# Altium project SAMA5D27-SOM1.PrjPcb (part 1 of 2)
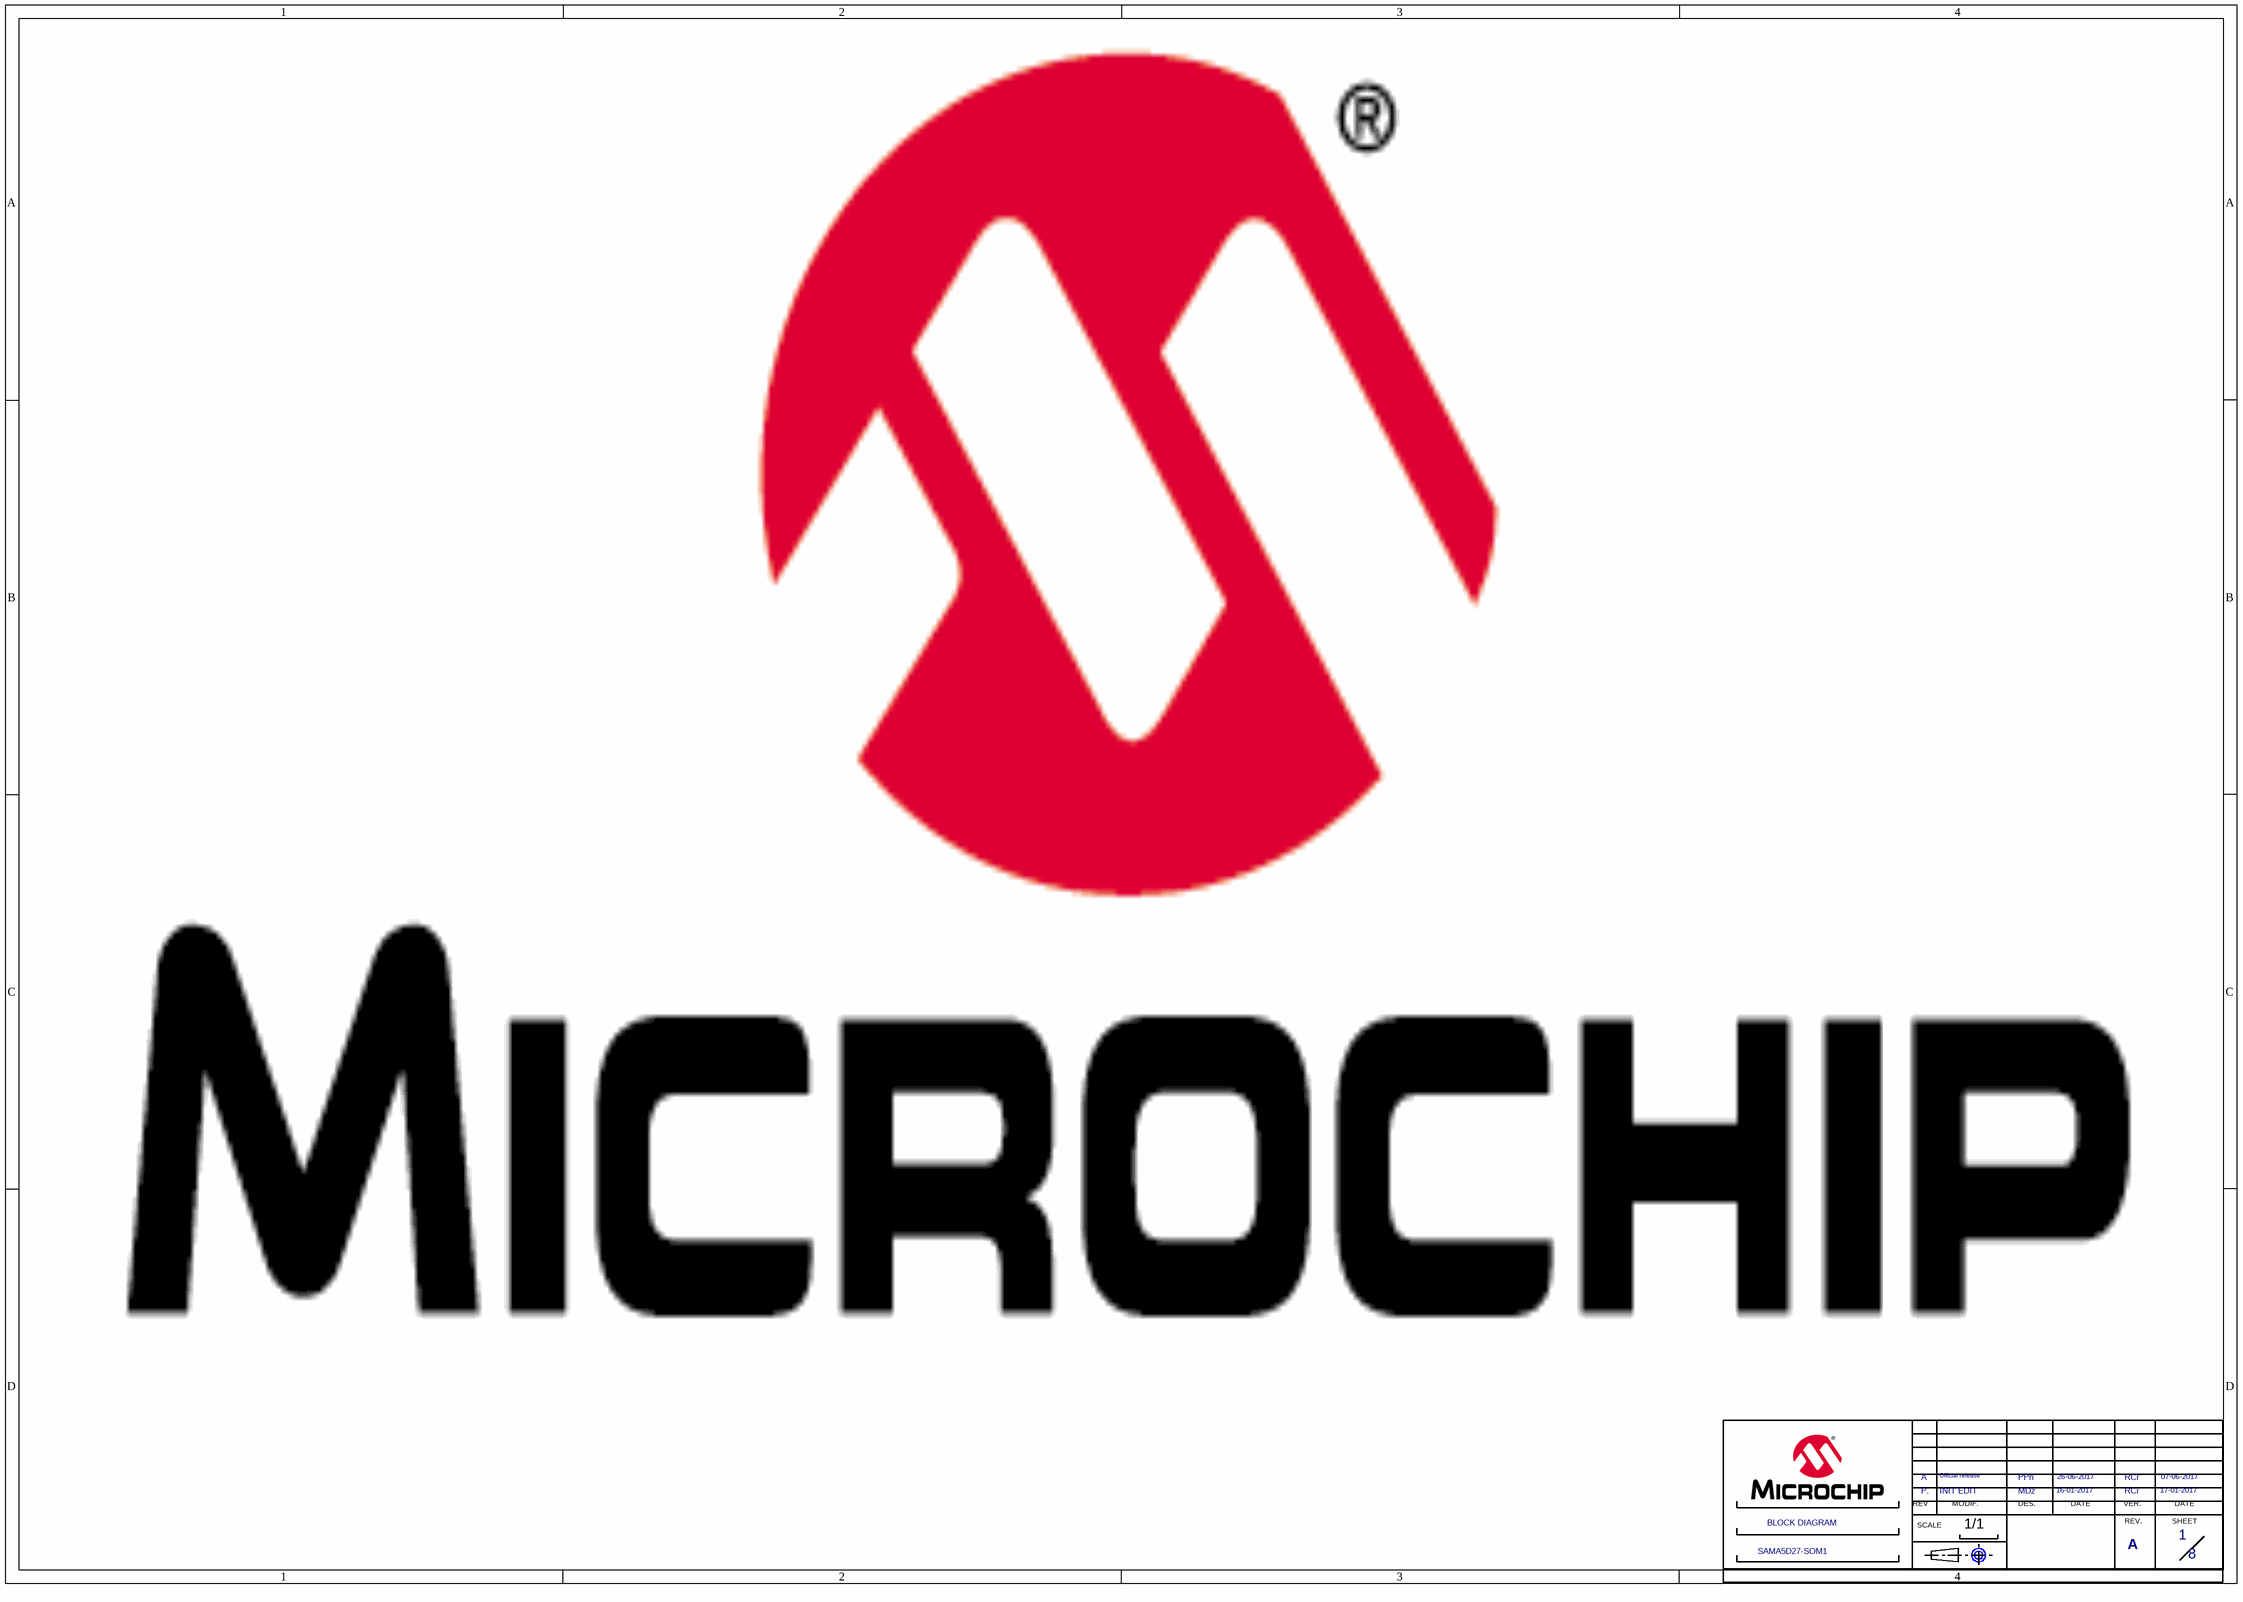
[diagram p0: 1-BLOCK DIAGRAM.SchDoc]
ProjectTitle: Project Title; ProjectRevisionSCH: A; ProjectRevisionFAB: A; ProjectRevisionASSY: A; ProjectRevisionART: A; ProjectPartNumber: MPU32; ProjectEngineer: TBD; ProjectDrawnBy: TBD; ProjectBoardNumber: TBD
8 sheets, 204 parts. Net scope: global (net labels, ports and power ports of the same name join across sheets).
Board file: SAMA5D27-SOM1-MFG-03.PcbDoc
Sheets:
  1-BLOCK DIAGRAM.SchDoc
  2-Supplies.SchDoc
  3-Microcontroller.SchDoc
  4-Microcontroller.SchDoc
  5-Memories.SchDoc
  6-Ethernet.SchDoc
  7-SOM PIO.SchDoc
  8-Mechanical.SchDoc

## Sheet 1-BLOCK DIAGRAM.SchDoc
size 420 x 297 mm; CompanyName: Microchip Technology Inc.; Organization: Microchip Technology; Address1: 2355 West Chandler Blvd.; Address2: Chandler, AZ  85224; Address4: USA; SheetTitle: **; Time: Time

### Parts
(Parts that share a designator on the sheet are numbered #1, #2 ... from top to bottom, then left to right.)
*#1  MODIF.A: INIT EDIT  SHEET NAME 2: BLOCK DIAGRAM  SHEET NAME 1: SAMA5D27-SOM1  REV B: A  VERIF B: RCr  VERIF DATE A: 17-01-2017  VERIF DATE B: 07-06-2017  Page Count: 8  Page Number: 1  DATE A: 16-01-2017  DATE B: 26-06-2017  DES A: MDz  DES B: PPn  MODIF.B: Official release  REV A: P.  (hidden comment: CARTOUCHE MICROCHIP)  (graphical)
?#1  (no value)  (graphical)

### Notes on the sheet
- Drawn By:
- Engineer:
- PartNumber:
- Project Title
- Sheet Title
- Size
- B
- Revision:
- Sch #:
- Date:
- Sheet
- Designed with
- Altium.com <http://go.altium.com/MicrochipLandingPage_Evaluation.html>
- File:
- (in symbol CARTOUCHE MICROCHIP) REV; MODIF.; DES.; DATE; VER.; SCALE; REV.; SHEET; 1/1

### Library data of the parts
*#1 = CARTOUCHE MICROCHIP: REV D: D; REV C: C; REV F: F; REV E: E; VERIF F: XXX; VERIF DATE F: XX-XXX-XX; MODIF.C: RevC; MODIF.D: RevD; MODIF.E: RevE; MODIF.F: RevF; VERIF E: XXX; VERIF D: XXX; VERIF C: RCr; VERIF A: RCr; VERIF DATE E: XX-XXX-XX; VERIF DATE D: XX-XXX-XX; VERIF DATE C: 07-06-2017; REV: A; FT: ?; Page Size: A; Page Create Date: june 19, 2004; DATE C: 07-06-2017; DATE D: XX-XXX-XX; DATE E: XX-XXX-XX; DATE F: XX-XXX-XX; DES E: XXX; DES F: XXX; DES C: XXX; DES D: XXX
?#1 = Title Block B

## Sheet 2-Supplies.SchDoc
size 420 x 297 mm; CompanyName: Microchip Technology Inc.; Organization: Microchip Technology; Address1: 2355 West Chandler Blvd.; Address2: Chandler, AZ  85224; Address4: USA; SheetTitle: **; Time: Time
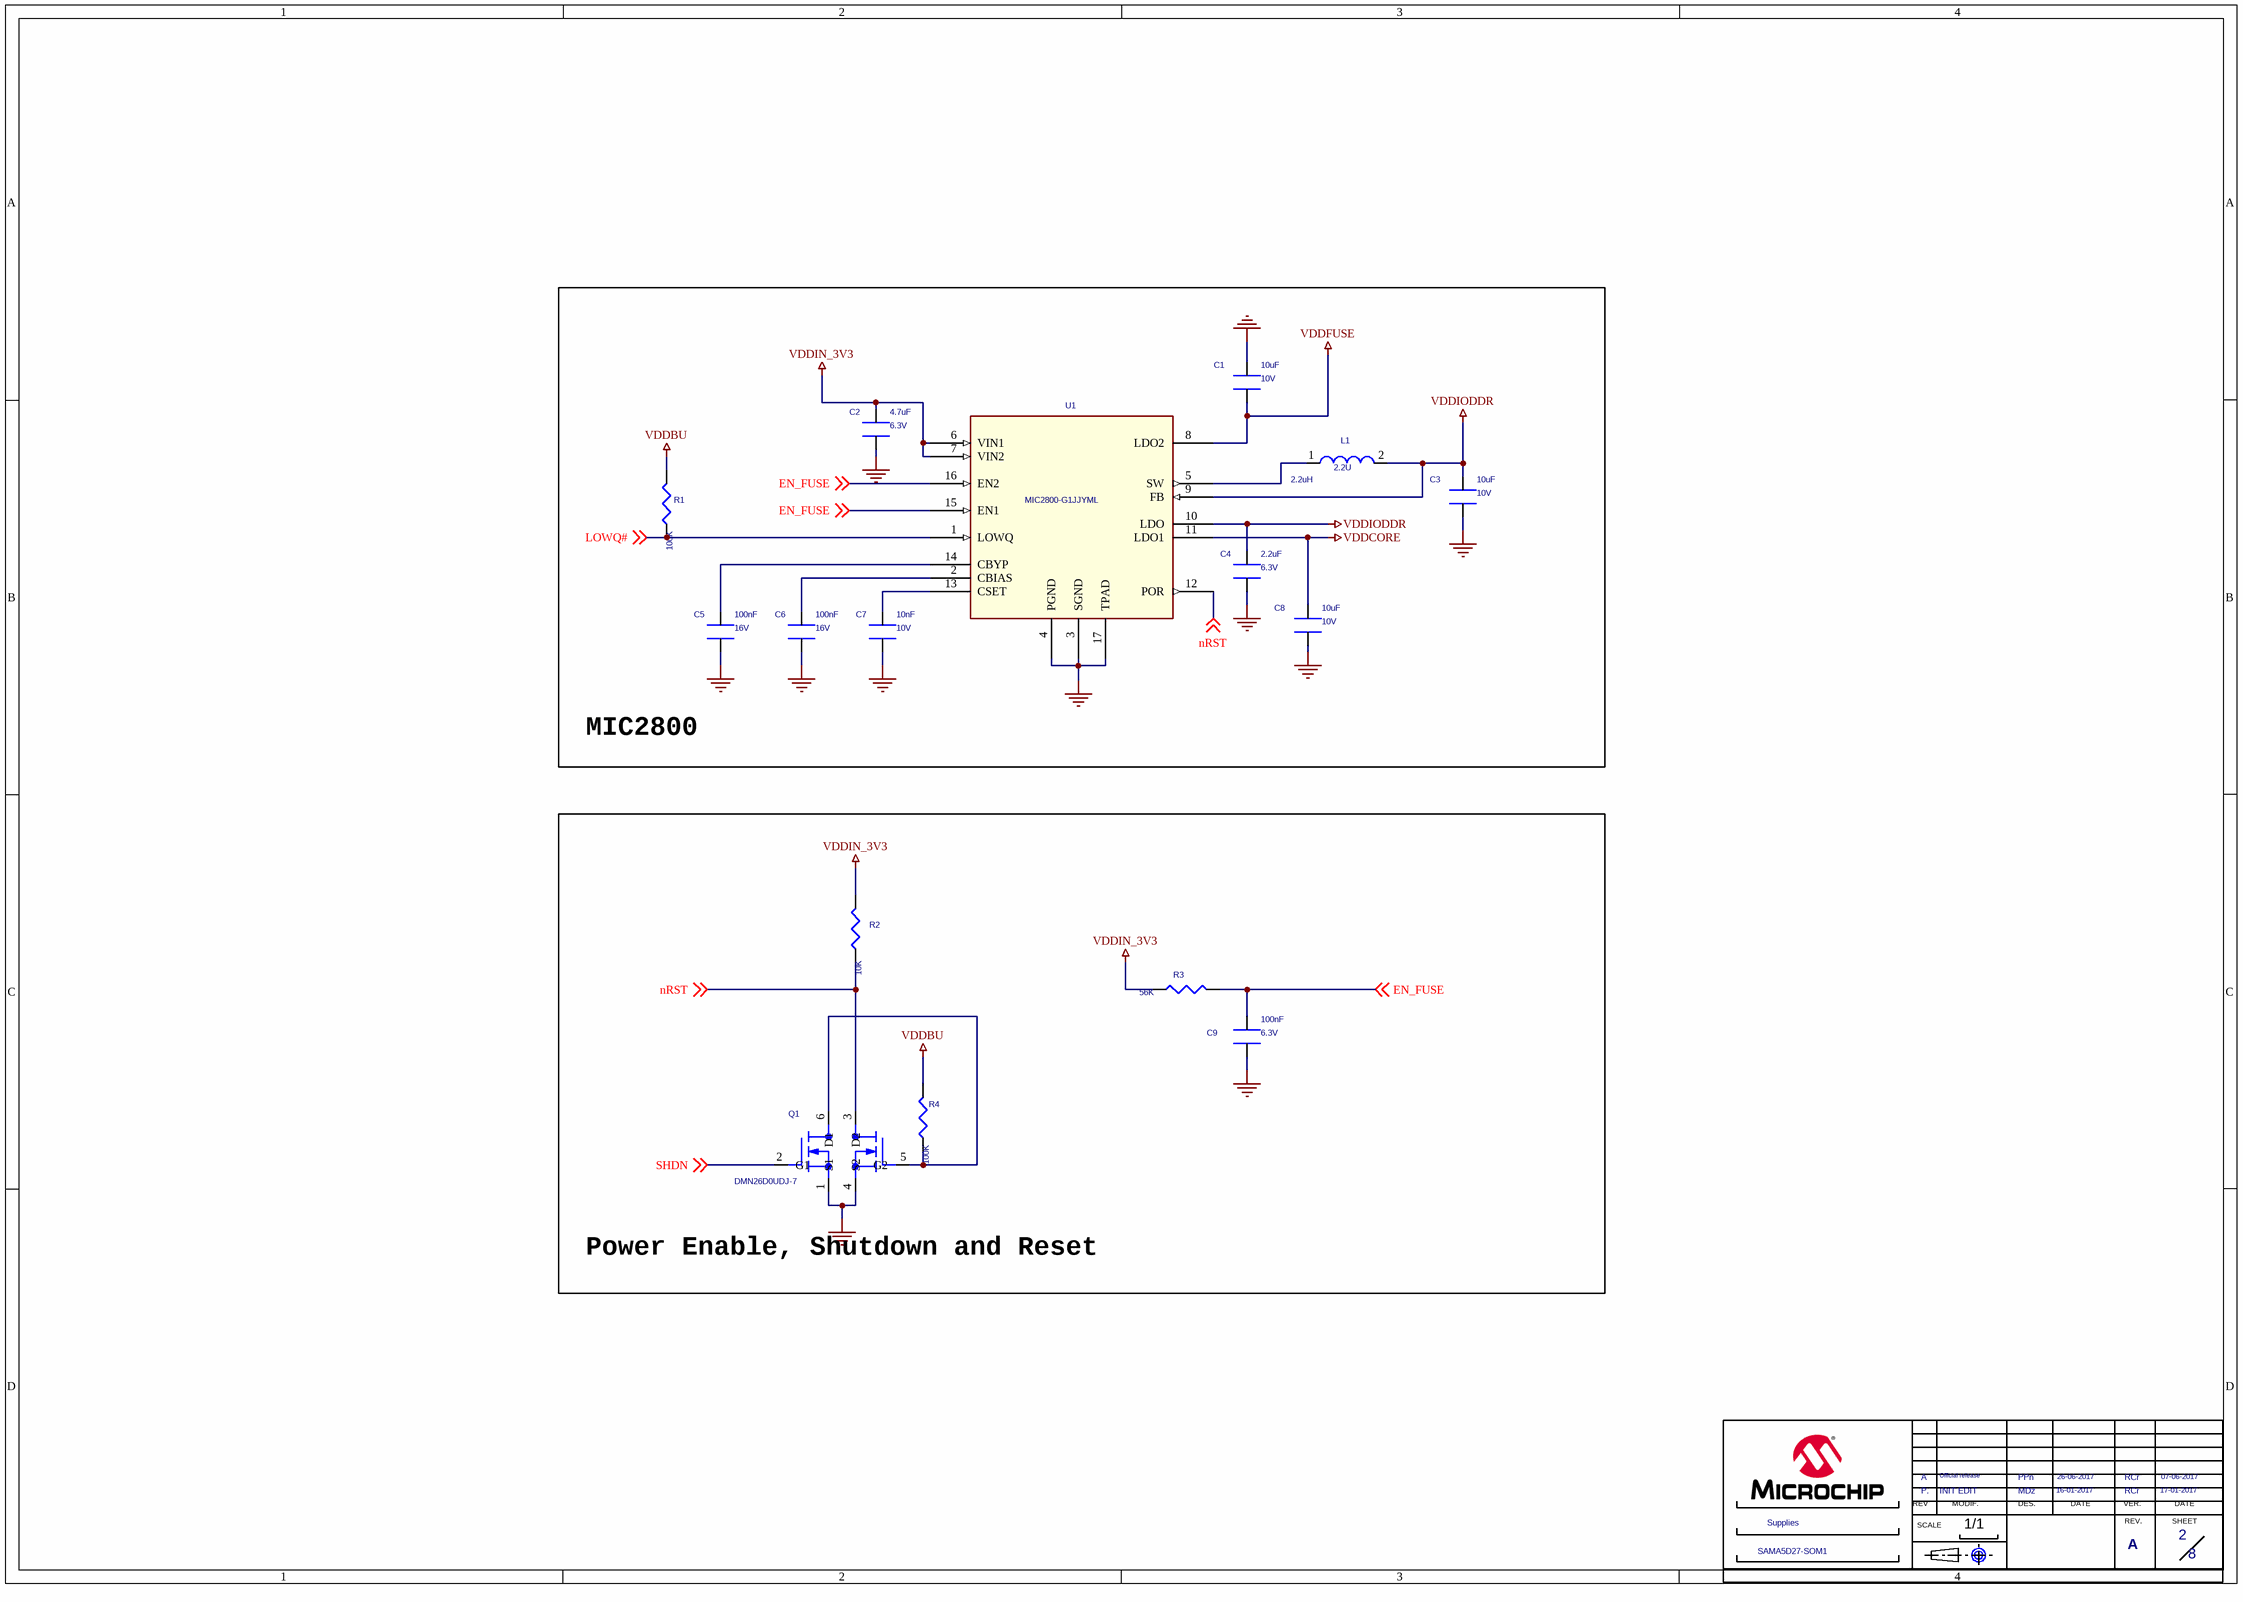
[diagram p1: 2-Supplies.SchDoc]

### Parts
(Parts that share a designator on the sheet are numbered #1, #2 ... from top to bottom, then left to right.)
*#2  MODIF.A: INIT EDIT  SHEET NAME 2: Supplies  SHEET NAME 1: SAMA5D27-SOM1  REV B: A  VERIF B: RCr  VERIF DATE A: 17-01-2017  VERIF DATE B: 07-06-2017  Page Count: 8  Page Number: 2  DATE A: 16-01-2017  DATE B: 26-06-2017  DES A: MDz  DES B: PPn  MODIF.B: Official release  REV A: P.  (hidden comment: CARTOUCHE MICROCHIP)  (graphical)
?#2  (no value)  (graphical)
C1  TENSION: 10V  VALEUR: 10uF  [C0603]  (hidden comment: xpF x% xV)
C2  TENSION: 6.3V  VALEUR: 4.7uF  [C0402]  (hidden comment: xpF x% xV)
C3  TENSION: 10V  VALEUR: 10uF  [C0603]  (hidden comment: xpF x% xV)
C4  TENSION: 6.3V  VALEUR: 2.2uF  [C0603]  (hidden comment: xpF x% xV)
C5  TENSION: 16V  VALEUR: 100nF  [C0402]  (hidden comment: xpF x% xV)
C6  TENSION: 16V  VALEUR: 100nF  [C0402]  (hidden comment: xpF x% xV)
C7  TENSION: 10V  VALEUR: 10nF  [C0201]  (hidden comment: xpF x% xV)
C8  TENSION: 10V  VALEUR: 10uF  [C0603]  (hidden comment: xpF x% xV)
C9  VALEUR: 100nF  TENSION: 6.3V  [C0201]  (hidden comment: xpF x% xV)
L1  2.2U  Valeur: 2.2uH  [L2520]
Q1  DMN26D0UDJ-7  [SOT963_01]
R1  VALEUR: 100K  [R0201]  (hidden comment: xR x% xW)
R2  VALEUR: 10K  [R0201]  (hidden comment: xR x% xW)
R3  VALEUR: 56K  [R0201]  (hidden comment: xR x% xW)
R4  VALEUR: 100K  [R0201]  (hidden comment: xR x% xW)
U1  MIC2800-G1JJYML  [QFN16_02]

### Blocks framed on the sheet
MIC2800: C1-C8 L1 R1 U1
Power Enable, Shutdown and Reset: C9 Q1 R2-R4

### Nets
GND: C1.2 C2.1 C3.1 C4.1 C5.1 C6.1 C7.1 C8.1 C9.1 Q1.1(S1) Q1.4(S2) U1.3(SGND) U1.4(PGND) U1.17(TPAD)
VDDBU: R1.2 R4.2
VDDCORE: C8.2 U1.11(LDO1)
VDDFUSE: C1.1 U1.8(LDO2)
VDDIN_3V3: C2.2 R2.2 R3.1 U1.6(VIN1) U1.7(VIN2)
VDDIODDR: C3.2 C4.2 L1.2 U1.9(FB) U1.10(LDO)
EN_FUSE: C9.2 R3.2 U1.15(EN1) U1.16(EN2) ; off-sheet EN_FUSE
LOWQ#: R1.1 U1.1(LOWQ) ; off-sheet LOWQ#
nRST: Q1.3(D2) R2.1 U1.12(POR) ; off-sheet nRST
SHDN: Q1.2(G1) ; off-sheet SHDN
NetC5_2: C5.2 U1.14(CBYP)
NetC6_2: C6.2 U1.2(CBIAS)
NetC7_2: C7.2 U1.13(CSET)
NetL1_1: L1.1 U1.5(SW)
NetQ1_5: Q1.5(G2) Q1.6(D1) R4.1

### Notes on the sheet
- Drawn By:
- Engineer:
- PartNumber:
- Project Title
- Sheet Title
- Size
- B
- Revision:
- Sch #:
- Date:
- Sheet
- Designed with
- Altium.com <http://go.altium.com/MicrochipLandingPage_Evaluation.html>
- File:
- (in symbol CARTOUCHE MICROCHIP) REV; MODIF.; DES.; DATE; VER.; SCALE; REV.; SHEET; 1/1

### Library data of the parts
*#2 = CARTOUCHE MICROCHIP: as *#1 on sheet 1-BLOCK DIAGRAM; VERIF E: XXX; VERIF D: XXX; VERIF C: RCr; VERIF A: RCr; VERIF DATE E: XX-XXX-XX; VERIF DATE D: XX-XXX-XX; VERIF DATE C: 07-06-2017; REV: A; FT: ?; Page Size: A; Page Create Date: june 19, 2004; DATE C: 07-06-2017; DATE D: XX-XXX-XX; DATE E: XX-XXX-XX; DATE F: XX-XXX-XX; DES E: XXX; DES F: XXX; DES C: XXX; DES D: XXX
?#2 = Title Block B
C1 C3 C8 = C0603-10uF-X5R-10V-10%: COURANT: xA; HAUTEUR: xmm; TOLERENCE: 10%; DESIGNATION: Condensateur CMS céramique; BOITIER: 0603; DIELECTRIQUE: X5R; TEMPERATURE: 40°C/+85°C
C2 = C0402-4.7uF-X5R-6.3V-10%: COURANT: xA; HAUTEUR: xmm; TOLERENCE: 10%; DESIGNATION: Condensateur CMS céramique; BOITIER: 0402; DIELECTRIQUE: X5R; TEMPERATURE: 40°C/+85°C
C4 = C0603-2.2uF-X7R-6.3V-10%: COURANT: xA; HAUTEUR: xmm; TOLERENCE: 10%; DESIGNATION: Condensateur CMS céramique; BOITIER: 0603; DIELECTRIQUE: X7R; TEMPERATURE: 40°C/+85°C
C5 C6 = C0402-100nF-X7R-16V-10%: COURANT: xA; HAUTEUR: xmm; TOLERENCE: 10%; DESIGNATION: Condensateur CMS céramique; BOITIER: 0402; DIELECTRIQUE: X7R; TEMPERATURE: 40°C/+85°C
C7 = C0201-10nF-X7R-10V: COURANT: xA; HAUTEUR: xmm; TOLERENCE: ?%; DESIGNATION: Condensateur CMS céramique; BOITIER: 0201; DIELECTRIQUE: X7R; TEMPERATURE: 40°C/+85°C
C9 = C0201-100nF-X5R-6.3V: DIELECTRIQUE: X5R; BOITIER: 0201; DESIGNATION: Condensateur CMS céramique; TOLERENCE: ?%; HAUTEUR: xmm; COURANT: xA; TEMPERATURE: 40°C/+85°C
L1 = MLP2520H2R2MT0S1: TOLERANCE: 20%; FABRICANT: TDK; type: ???; DESIGNATION: Inductance CMS; TEMPERATURE: -40°C/+125°C; partnumber: MLP2520H2R2MT0S1
Q1 = DMN26D0UDJ-7: FABRICANT: Diodes Incorporated; DESIGNATION: Mosfet dual N-CH 20V 0.23A; TEMPERATURE: -55°C/+150°C
R1 R4 = R0201-100K-5%: TENSION: xV; BOITIER: 0201; COURANT: xA; DESIGNATION: Resistance CMS; TOLERANCE: 5%; PUISSANCE: xW; TEMPERATURE: -40°C/+85°C
R2 = R0201-10K-5%: TENSION: xV; BOITIER: 0201; COURANT: xA; DESIGNATION: Resistance CMS; TOLERANCE: 5%; PUISSANCE: xW; TEMPERATURE: -40°C/+85°C
R3 = R0201-56K-5%: TOLERANCE: 5%; DESIGNATION: Resistance CMS; COURANT: xA; BOITIER: 0201; TENSION: xV; TEMPERATURE: -40°C/+85°C; PUISSANCE: xW
U1 = MIC2800-G1JJYML: FABRICANT: MICROCHIP; DESIGNATION: Linear Voltage Regulators; TEMPERATURE: -40°C/+125°C

## Sheet 3-Microcontroller.SchDoc
size 420 x 297 mm; CompanyName: Microchip Technology Inc.; Organization: Microchip Technology; Address1: 2355 West Chandler Blvd.; Address2: Chandler, AZ  85224; Address4: USA; SheetTitle: **; Time: Time
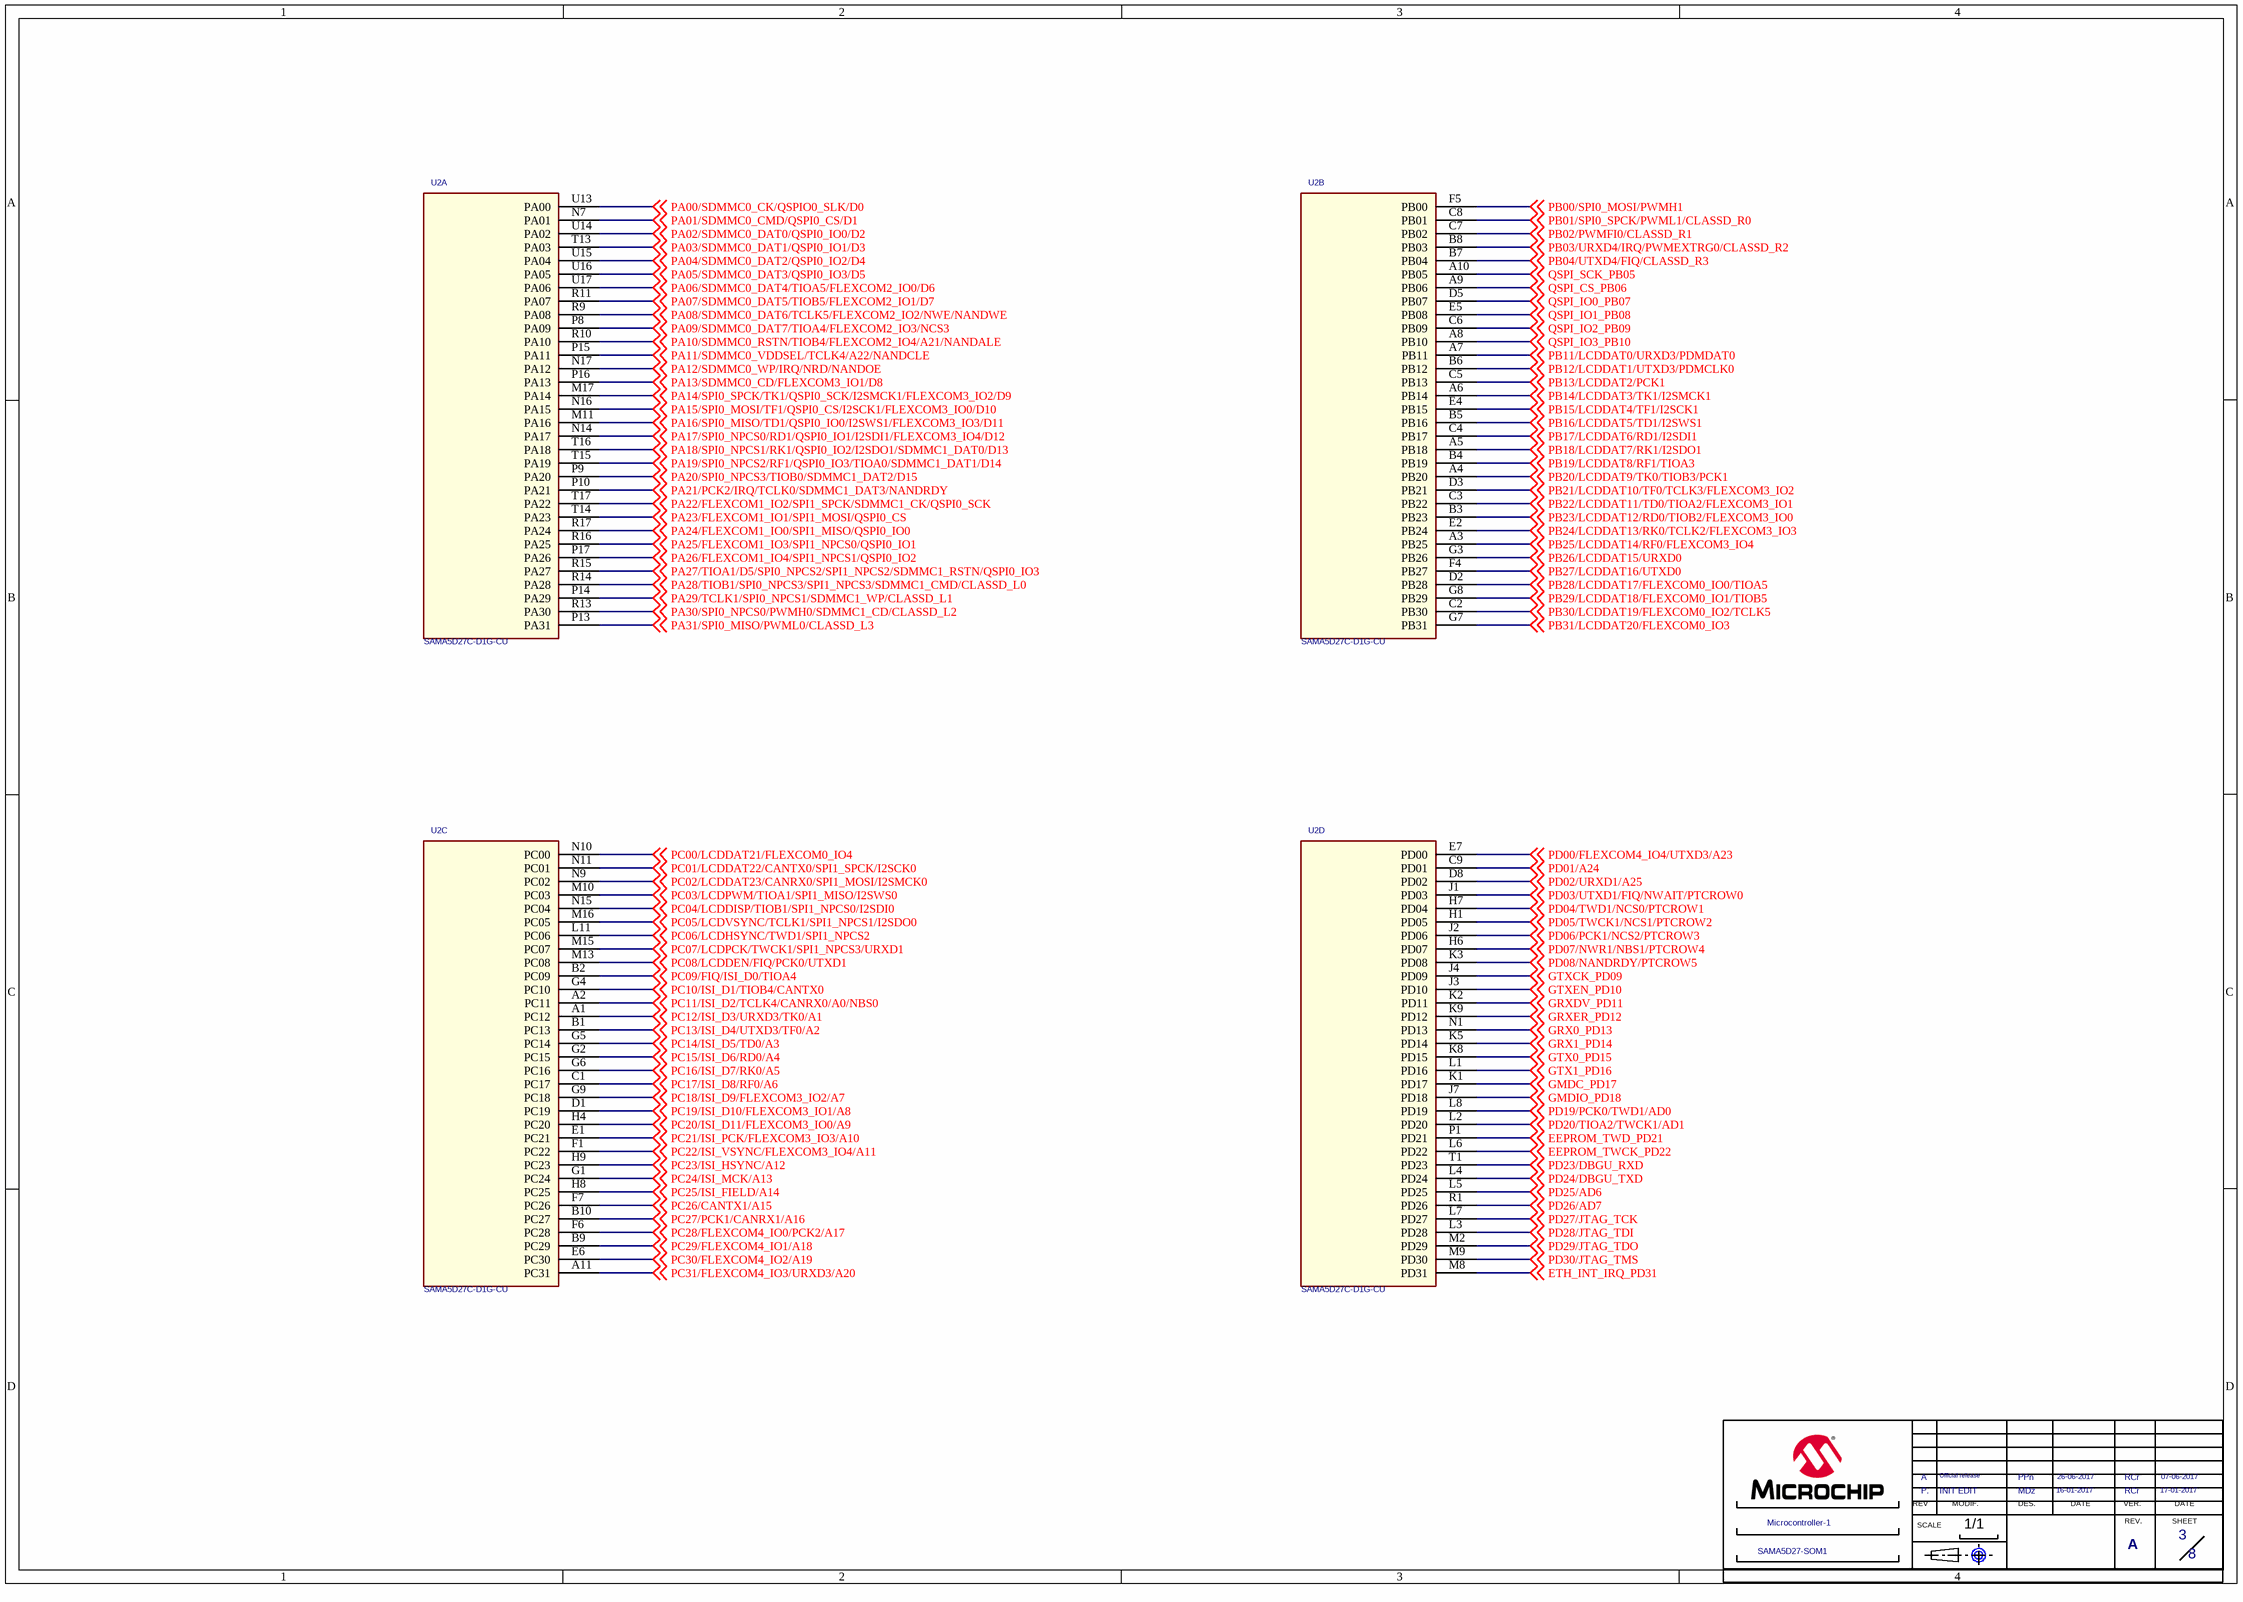
[diagram p2: 3-Microcontroller.SchDoc]

### Parts
(Parts that share a designator on the sheet are numbered #1, #2 ... from top to bottom, then left to right.)
*#3  MODIF.A: INIT EDIT  SHEET NAME 2: Microcontroller-1  SHEET NAME 1: SAMA5D27-SOM1  REV B: A  VERIF B: RCr  VERIF DATE A: 17-01-2017  VERIF DATE B: 07-06-2017  Page Count: 8  Page Number: 3  DATE A: 16-01-2017  DATE B: 26-06-2017  DES A: MDz  DES B: PPn  MODIF.B: Official release  REV A: P.  (hidden comment: CARTOUCHE MICROCHIP)  (graphical)
?#3  (no value)  (graphical)
U2  SAMA5D27C-D1G-CU  [BGA289_02]  (parts A,B,C,D of 7)

### Nets
EEPROM_TWCK_PD22: U2.L6(PD22) ; off-sheet EEPROM_TWCK_PD22
EEPROM_TWD_PD21: U2.P1(PD21) ; off-sheet EEPROM_TWD_PD21
ETH_INT_IRQ_PD31: U2.M8(PD31) ; off-sheet ETH_INT_IRQ_PD31
GMDC_PD17: U2.K1(PD17) ; off-sheet GMDC_PD17
GMDIO_PD18: U2.J7(PD18) ; off-sheet GMDIO_PD18
GRX0_PD13: U2.N1(PD13) ; off-sheet GRX0_PD13
GRX1_PD14: U2.K5(PD14) ; off-sheet GRX1_PD14
GRXDV_PD11: U2.K2(PD11) ; off-sheet GRXDV_PD11
GRXER_PD12: U2.K9(PD12) ; off-sheet GRXER_PD12
GTX0_PD15: U2.K8(PD15) ; off-sheet GTX0_PD15
GTX1_PD16: U2.L1(PD16) ; off-sheet GTX1_PD16
GTXCK_PD09: U2.J4(PD09) ; off-sheet GTXCK_PD09
GTXEN_PD10: U2.J3(PD10) ; off-sheet GTXEN_PD10
PA00/SDMMC0_CK/QSPIO0_SLK/D0: U2.U13(PA00) ; off-sheet PA00/SDMMC0_CK/QSPIO0_SLK/D0
PA01/SDMMC0_CMD/QSPI0_CS/D1: U2.N7(PA01) ; off-sheet PA01/SDMMC0_CMD/QSPI0_CS/D1
PA02/SDMMC0_DAT0/QSPI0_IO0/D2: U2.U14(PA02) ; off-sheet PA02/SDMMC0_DAT0/QSPI0_IO0/D2
PA03/SDMMC0_DAT1/QSPI0_IO1/D3: U2.T13(PA03) ; off-sheet PA03/SDMMC0_DAT1/QSPI0_IO1/D3
PA04/SDMMC0_DAT2/QSPI0_IO2/D4: U2.U15(PA04) ; off-sheet PA04/SDMMC0_DAT2/QSPI0_IO2/D4
PA05/SDMMC0_DAT3/QSPI0_IO3/D5: U2.U16(PA05) ; off-sheet PA05/SDMMC0_DAT3/QSPI0_IO3/D5
PA06/SDMMC0_DAT4/TIOA5/FLEXCOM2_IO0/D6: U2.U17(PA06) ; off-sheet PA06/SDMMC0_DAT4/TIOA5/FLEXCOM2_IO0/D6
PA07/SDMMC0_DAT5/TIOB5/FLEXCOM2_IO1/D7: U2.R11(PA07) ; off-sheet PA07/SDMMC0_DAT5/TIOB5/FLEXCOM2_IO1/D7
PA08/SDMMC0_DAT6/TCLK5/FLEXCOM2_IO2/NWE/NANDWE: U2.R9(PA08) ; off-sheet PA08/SDMMC0_DAT6/TCLK5/FLEXCOM2_IO2/NWE/NANDWE
PA09/SDMMC0_DAT7/TIOA4/FLEXCOM2_IO3/NCS3: U2.P8(PA09) ; off-sheet PA09/SDMMC0_DAT7/TIOA4/FLEXCOM2_IO3/NCS3
PA10/SDMMC0_RSTN/TIOB4/FLEXCOM2_IO4/A21/NANDALE: U2.R10(PA10) ; off-sheet PA10/SDMMC0_RSTN/TIOB4/FLEXCOM2_IO4/A21/NANDALE
PA11/SDMMC0_VDDSEL/TCLK4/A22/NANDCLE: U2.P15(PA11) ; off-sheet PA11/SDMMC0_VDDSEL/TCLK4/A22/NANDCLE
PA12/SDMMC0_WP/IRQ/NRD/NANDOE: U2.N17(PA12) ; off-sheet PA12/SDMMC0_WP/IRQ/NRD/NANDOE
PA13/SDMMC0_CD/FLEXCOM3_IO1/D8: U2.P16(PA13) ; off-sheet PA13/SDMMC0_CD/FLEXCOM3_IO1/D8
PA14/SPI0_SPCK/TK1/QSPI0_SCK/I2SMCK1/FLEXCOM3_IO2/D9: U2.M17(PA14) ; off-sheet PA14/SPI0_SPCK/TK1/QSPI0_SCK/I2SMCK1/FLEXCOM3_IO2/D9
PA15/SPI0_MOSI/TF1/QSPI0_CS/I2SCK1/FLEXCOM3_IO0/D10: U2.N16(PA15) ; off-sheet PA15/SPI0_MOSI/TF1/QSPI0_CS/I2SCK1/FLEXCOM3_IO0/D10
PA16/SPI0_MISO/TD1/QSPI0_IO0/I2SWS1/FLEXCOM3_IO3/D11: U2.M11(PA16) ; off-sheet PA16/SPI0_MISO/TD1/QSPI0_IO0/I2SWS1/FLEXCOM3_IO3/D11
PA17/SPI0_NPCS0/RD1/QSPI0_IO1/I2SDI1/FLEXCOM3_IO4/D12: U2.N14(PA17) ; off-sheet PA17/SPI0_NPCS0/RD1/QSPI0_IO1/I2SDI1/FLEXCOM3_IO4/D12
PA18/SPI0_NPCS1/RK1/QSPI0_IO2/I2SDO1/SDMMC1_DAT0/D13: U2.T16(PA18) ; off-sheet PA18/SPI0_NPCS1/RK1/QSPI0_IO2/I2SDO1/SDMMC1_DAT0/D13
PA19/SPI0_NPCS2/RF1/QSPI0_IO3/TIOA0/SDMMC1_DAT1/D14: U2.T15(PA19) ; off-sheet PA19/SPI0_NPCS2/RF1/QSPI0_IO3/TIOA0/SDMMC1_DAT1/D14
PA20/SPI0_NPCS3/TIOB0/SDMMC1_DAT2/D15: U2.P9(PA20) ; off-sheet PA20/SPI0_NPCS3/TIOB0/SDMMC1_DAT2/D15
PA21/PCK2/IRQ/TCLK0/SDMMC1_DAT3/NANDRDY: U2.P10(PA21) ; off-sheet PA21/PCK2/IRQ/TCLK0/SDMMC1_DAT3/NANDRDY
PA22/FLEXCOM1_IO2/SPI1_SPCK/SDMMC1_CK/QSPI0_SCK: U2.T17(PA22) ; off-sheet PA22/FLEXCOM1_IO2/SPI1_SPCK/SDMMC1_CK/QSPI0_SCK
PA23/FLEXCOM1_IO1/SPI1_MOSI/QSPI0_CS: U2.T14(PA23) ; off-sheet PA23/FLEXCOM1_IO1/SPI1_MOSI/QSPI0_CS
PA24/FLEXCOM1_IO0/SPI1_MISO/QSPI0_IO0: U2.R17(PA24) ; off-sheet PA24/FLEXCOM1_IO0/SPI1_MISO/QSPI0_IO0
PA25/FLEXCOM1_IO3/SPI1_NPCS0/QSPI0_IO1: U2.R16(PA25) ; off-sheet PA25/FLEXCOM1_IO3/SPI1_NPCS0/QSPI0_IO1
PA26/FLEXCOM1_IO4/SPI1_NPCS1/QSPI0_IO2: U2.P17(PA26) ; off-sheet PA26/FLEXCOM1_IO4/SPI1_NPCS1/QSPI0_IO2
PA27/TIOA1/D5/SPI0_NPCS2/SPI1_NPCS2/SDMMC1_RSTN/QSPI0_IO3: U2.R15(PA27) ; off-sheet PA27/TIOA1/D5/SPI0_NPCS2/SPI1_NPCS2/SDMMC1_RSTN/QSPI0_IO3
PA28/TIOB1/SPI0_NPCS3/SPI1_NPCS3/SDMMC1_CMD/CLASSD_L0: U2.R14(PA28) ; off-sheet PA28/TIOB1/SPI0_NPCS3/SPI1_NPCS3/SDMMC1_CMD/CLASSD_L0
PA29/TCLK1/SPI0_NPCS1/SDMMC1_WP/CLASSD_L1: U2.P14(PA29) ; off-sheet PA29/TCLK1/SPI0_NPCS1/SDMMC1_WP/CLASSD_L1
PA30/SPI0_NPCS0/PWMH0/SDMMC1_CD/CLASSD_L2: U2.R13(PA30) ; off-sheet PA30/SPI0_NPCS0/PWMH0/SDMMC1_CD/CLASSD_L2
PA31/SPI0_MISO/PWML0/CLASSD_L3: U2.P13(PA31) ; off-sheet PA31/SPI0_MISO/PWML0/CLASSD_L3
PB00/SPI0_MOSI/PWMH1: U2.F5(PB00) ; off-sheet PB00/SPI0_MOSI/PWMH1
PB01/SPI0_SPCK/PWML1/CLASSD_R0: U2.C8(PB01) ; off-sheet PB01/SPI0_SPCK/PWML1/CLASSD_R0
PB02/PWMFI0/CLASSD_R1: U2.C7(PB02) ; off-sheet PB02/PWMFI0/CLASSD_R1
PB03/URXD4/IRQ/PWMEXTRG0/CLASSD_R2: U2.B8(PB03) ; off-sheet PB03/URXD4/IRQ/PWMEXTRG0/CLASSD_R2
PB04/UTXD4/FIQ/CLASSD_R3: U2.B7(PB04) ; off-sheet PB04/UTXD4/FIQ/CLASSD_R3
PB11/LCDDAT0/URXD3/PDMDAT0: U2.A7(PB11) ; off-sheet PB11/LCDDAT0/URXD3/PDMDAT0
PB12/LCDDAT1/UTXD3/PDMCLK0: U2.B6(PB12) ; off-sheet PB12/LCDDAT1/UTXD3/PDMCLK0
PB13/LCDDAT2/PCK1: U2.C5(PB13) ; off-sheet PB13/LCDDAT2/PCK1
PB14/LCDDAT3/TK1/I2SMCK1: U2.A6(PB14) ; off-sheet PB14/LCDDAT3/TK1/I2SMCK1
PB15/LCDDAT4/TF1/I2SCK1: U2.E4(PB15) ; off-sheet PB15/LCDDAT4/TF1/I2SCK1
PB16/LCDDAT5/TD1/I2SWS1: U2.B5(PB16) ; off-sheet PB16/LCDDAT5/TD1/I2SWS1
PB17/LCDDAT6/RD1/I2SDI1: U2.C4(PB17) ; off-sheet PB17/LCDDAT6/RD1/I2SDI1
PB18/LCDDAT7/RK1/I2SDO1: U2.A5(PB18) ; off-sheet PB18/LCDDAT7/RK1/I2SDO1
PB19/LCDDAT8/RF1/TIOA3: U2.B4(PB19) ; off-sheet PB19/LCDDAT8/RF1/TIOA3
PB20/LCDDAT9/TK0/TIOB3/PCK1: U2.A4(PB20) ; off-sheet PB20/LCDDAT9/TK0/TIOB3/PCK1
PB21/LCDDAT10/TF0/TCLK3/FLEXCOM3_IO2: U2.D3(PB21) ; off-sheet PB21/LCDDAT10/TF0/TCLK3/FLEXCOM3_IO2
PB22/LCDDAT11/TD0/TIOA2/FLEXCOM3_IO1: U2.C3(PB22) ; off-sheet PB22/LCDDAT11/TD0/TIOA2/FLEXCOM3_IO1
PB23/LCDDAT12/RD0/TIOB2/FLEXCOM3_IO0: U2.B3(PB23) ; off-sheet PB23/LCDDAT12/RD0/TIOB2/FLEXCOM3_IO0
PB24/LCDDAT13/RK0/TCLK2/FLEXCOM3_IO3: U2.E2(PB24) ; off-sheet PB24/LCDDAT13/RK0/TCLK2/FLEXCOM3_IO3
PB25/LCDDAT14/RF0/FLEXCOM3_IO4: U2.A3(PB25) ; off-sheet PB25/LCDDAT14/RF0/FLEXCOM3_IO4
PB26/LCDDAT15/URXD0: U2.G3(PB26) ; off-sheet PB26/LCDDAT15/URXD0
PB27/LCDDAT16/UTXD0: U2.F4(PB27) ; off-sheet PB27/LCDDAT16/UTXD0
PB28/LCDDAT17/FLEXCOM0_IO0/TIOA5: U2.D2(PB28) ; off-sheet PB28/LCDDAT17/FLEXCOM0_IO0/TIOA5
PB29/LCDDAT18/FLEXCOM0_IO1/TIOB5: U2.G8(PB29) ; off-sheet PB29/LCDDAT18/FLEXCOM0_IO1/TIOB5
PB30/LCDDAT19/FLEXCOM0_IO2/TCLK5: U2.C2(PB30) ; off-sheet PB30/LCDDAT19/FLEXCOM0_IO2/TCLK5
PB31/LCDDAT20/FLEXCOM0_IO3: U2.G7(PB31) ; off-sheet PB31/LCDDAT20/FLEXCOM0_IO3
PC00/LCDDAT21/FLEXCOM0_IO4: U2.N10(PC00) ; off-sheet PC00/LCDDAT21/FLEXCOM0_IO4
PC01/LCDDAT22/CANTX0/SPI1_SPCK/I2SCK0: U2.N11(PC01) ; off-sheet PC01/LCDDAT22/CANTX0/SPI1_SPCK/I2SCK0
PC02/LCDDAT23/CANRX0/SPI1_MOSI/I2SMCK0: U2.N9(PC02) ; off-sheet PC02/LCDDAT23/CANRX0/SPI1_MOSI/I2SMCK0
PC03/LCDPWM/TIOA1/SPI1_MISO/I2SWS0: U2.M10(PC03) ; off-sheet PC03/LCDPWM/TIOA1/SPI1_MISO/I2SWS0
PC04/LCDDISP/TIOB1/SPI1_NPCS0/I2SDI0: U2.N15(PC04) ; off-sheet PC04/LCDDISP/TIOB1/SPI1_NPCS0/I2SDI0
PC05/LCDVSYNC/TCLK1/SPI1_NPCS1/I2SDO0: U2.M16(PC05) ; off-sheet PC05/LCDVSYNC/TCLK1/SPI1_NPCS1/I2SDO0
PC06/LCDHSYNC/TWD1/SPI1_NPCS2: U2.L11(PC06) ; off-sheet PC06/LCDHSYNC/TWD1/SPI1_NPCS2
PC07/LCDPCK/TWCK1/SPI1_NPCS3/URXD1: U2.M15(PC07) ; off-sheet PC07/LCDPCK/TWCK1/SPI1_NPCS3/URXD1
PC08/LCDDEN/FIQ/PCK0/UTXD1: U2.M13(PC08) ; off-sheet PC08/LCDDEN/FIQ/PCK0/UTXD1
PC09/FIQ/ISI_D0/TIOA4: U2.B2(PC09) ; off-sheet PC09/FIQ/ISI_D0/TIOA4
PC10/ISI_D1/TIOB4/CANTX0: U2.G4(PC10) ; off-sheet PC10/ISI_D1/TIOB4/CANTX0
PC11/ISI_D2/TCLK4/CANRX0/A0/NBS0: U2.A2(PC11) ; off-sheet PC11/ISI_D2/TCLK4/CANRX0/A0/NBS0
PC12/ISI_D3/URXD3/TK0/A1: U2.A1(PC12) ; off-sheet PC12/ISI_D3/URXD3/TK0/A1
PC13/ISI_D4/UTXD3/TF0/A2: U2.B1(PC13) ; off-sheet PC13/ISI_D4/UTXD3/TF0/A2
PC14/ISI_D5/TD0/A3: U2.G5(PC14) ; off-sheet PC14/ISI_D5/TD0/A3
PC15/ISI_D6/RD0/A4: U2.G2(PC15) ; off-sheet PC15/ISI_D6/RD0/A4
PC16/ISI_D7/RK0/A5: U2.G6(PC16) ; off-sheet PC16/ISI_D7/RK0/A5
PC17/ISI_D8/RF0/A6: U2.C1(PC17) ; off-sheet PC17/ISI_D8/RF0/A6
PC18/ISI_D9/FLEXCOM3_IO2/A7: U2.G9(PC18) ; off-sheet PC18/ISI_D9/FLEXCOM3_IO2/A7
PC19/ISI_D10/FLEXCOM3_IO1/A8: U2.D1(PC19) ; off-sheet PC19/ISI_D10/FLEXCOM3_IO1/A8
PC20/ISI_D11/FLEXCOM3_IO0/A9: U2.H4(PC20) ; off-sheet PC20/ISI_D11/FLEXCOM3_IO0/A9
PC21/ISI_PCK/FLEXCOM3_IO3/A10: U2.E1(PC21) ; off-sheet PC21/ISI_PCK/FLEXCOM3_IO3/A10
PC22/ISI_VSYNC/FLEXCOM3_IO4/A11: U2.F1(PC22) ; off-sheet PC22/ISI_VSYNC/FLEXCOM3_IO4/A11
PC23/ISI_HSYNC/A12: U2.H9(PC23) ; off-sheet PC23/ISI_HSYNC/A12
PC24/ISI_MCK/A13: U2.G1(PC24) ; off-sheet PC24/ISI_MCK/A13
PC25/ISI_FIELD/A14: U2.H8(PC25) ; off-sheet PC25/ISI_FIELD/A14
PC26/CANTX1/A15: U2.F7(PC26) ; off-sheet PC26/CANTX1/A15
PC27/PCK1/CANRX1/A16: U2.B10(PC27) ; off-sheet PC27/PCK1/CANRX1/A16
PC28/FLEXCOM4_IO0/PCK2/A17: U2.F6(PC28) ; off-sheet PC28/FLEXCOM4_IO0/PCK2/A17
PC29/FLEXCOM4_IO1/A18: U2.B9(PC29) ; off-sheet PC29/FLEXCOM4_IO1/A18
PC30/FLEXCOM4_IO2/A19: U2.E6(PC30) ; off-sheet PC30/FLEXCOM4_IO2/A19
PC31/FLEXCOM4_IO3/URXD3/A20: U2.A11(PC31) ; off-sheet PC31/FLEXCOM4_IO3/URXD3/A20
PD00/FLEXCOM4_IO4/UTXD3/A23: U2.E7(PD00) ; off-sheet PD00/FLEXCOM4_IO4/UTXD3/A23
PD01/A24: U2.C9(PD01) ; off-sheet PD01/A24
PD02/URXD1/A25: U2.D8(PD02) ; off-sheet PD02/URXD1/A25
PD03/UTXD1/FIQ/NWAIT/PTCROW0: U2.J1(PD03) ; off-sheet PD03/UTXD1/FIQ/NWAIT/PTCROW0
PD04/TWD1/NCS0/PTCROW1: U2.H7(PD04) ; off-sheet PD04/TWD1/NCS0/PTCROW1
PD05/TWCK1/NCS1/PTCROW2: U2.H1(PD05) ; off-sheet PD05/TWCK1/NCS1/PTCROW2
PD06/PCK1/NCS2/PTCROW3: U2.J2(PD06) ; off-sheet PD06/PCK1/NCS2/PTCROW3
PD07/NWR1/NBS1/PTCROW4: U2.H6(PD07) ; off-sheet PD07/NWR1/NBS1/PTCROW4
PD08/NANDRDY/PTCROW5: U2.K3(PD08) ; off-sheet PD08/NANDRDY/PTCROW5
PD19/PCK0/TWD1/AD0: U2.L8(PD19) ; off-sheet PD19/PCK0/TWD1/AD0
PD20/TIOA2/TWCK1/AD1: U2.L2(PD20) ; off-sheet PD20/TIOA2/TWCK1/AD1
PD23/DBGU_RXD: U2.T1(PD23) ; off-sheet PD23/DBGU_RXD
PD24/DBGU_TXD: U2.L4(PD24) ; off-sheet PD24/DBGU_TXD
PD25/AD6: U2.L5(PD25) ; off-sheet PD25/AD6
PD26/AD7: U2.R1(PD26) ; off-sheet PD26/AD7
PD27/JTAG_TCK: U2.L7(PD27) ; off-sheet PD27/JTAG_TCK
PD28/JTAG_TDI: U2.L3(PD28) ; off-sheet PD28/JTAG_TDI
PD29/JTAG_TDO: U2.M2(PD29) ; off-sheet PD29/JTAG_TDO
PD30/JTAG_TMS: U2.M9(PD30) ; off-sheet PD30/JTAG_TMS
QSPI_CS_PB06: U2.A9(PB06) ; off-sheet QSPI_CS_PB06
QSPI_IO0_PB07: U2.D5(PB07) ; off-sheet QSPI_IO0_PB07
QSPI_IO1_PB08: U2.E5(PB08) ; off-sheet QSPI_IO1_PB08
QSPI_IO2_PB09: U2.C6(PB09) ; off-sheet QSPI_IO2_PB09
QSPI_IO3_PB10: U2.A8(PB10) ; off-sheet QSPI_IO3_PB10
QSPI_SCK_PB05: U2.A10(PB05) ; off-sheet QSPI_SCK_PB05

### Notes on the sheet
- Drawn By:
- Engineer:
- PartNumber:
- Project Title
- Sheet Title
- Size
- B
- Revision:
- Sch #:
- Date:
- Sheet
- Designed with
- Altium.com <http://go.altium.com/MicrochipLandingPage_Evaluation.html>
- File:
- (in symbol CARTOUCHE MICROCHIP) REV; MODIF.; DES.; DATE; VER.; SCALE; REV.; SHEET; 1/1

### Library data of the parts
*#3 = CARTOUCHE MICROCHIP: as *#1 on sheet 1-BLOCK DIAGRAM; VERIF E: XXX; VERIF D: XXX; VERIF C: RCr; VERIF A: RCr; VERIF DATE E: XX-XXX-XX; VERIF DATE D: XX-XXX-XX; VERIF DATE C: 07-06-2017; REV: A; FT: ?; Page Size: A; Page Create Date: june 19, 2004; DATE C: 07-06-2017; DATE D: XX-XXX-XX; DATE E: XX-XXX-XX; DATE F: XX-XXX-XX; DES E: XXX; DES F: XXX; DES C: XXX; DES D: XXX
?#3 = Title Block B
U2 = SAMA5D27C-D1G-CU: DESIGNATION: SAMA5D27-SiP; FABRICANT: ATMEL; SPLIT_INST: TRUE; SWAP_INFO: (S1+S2+S3+S4+S5+S6+S7); TEMPERATURE: -40°C/+85°C

## Sheet 4-Microcontroller.SchDoc
size 420 x 297 mm; CompanyName: Microchip Technology Inc.; Organization: Microchip Technology; Address1: 2355 West Chandler Blvd.; Address2: Chandler, AZ  85224; Address4: USA; SheetTitle: **; Time: Time
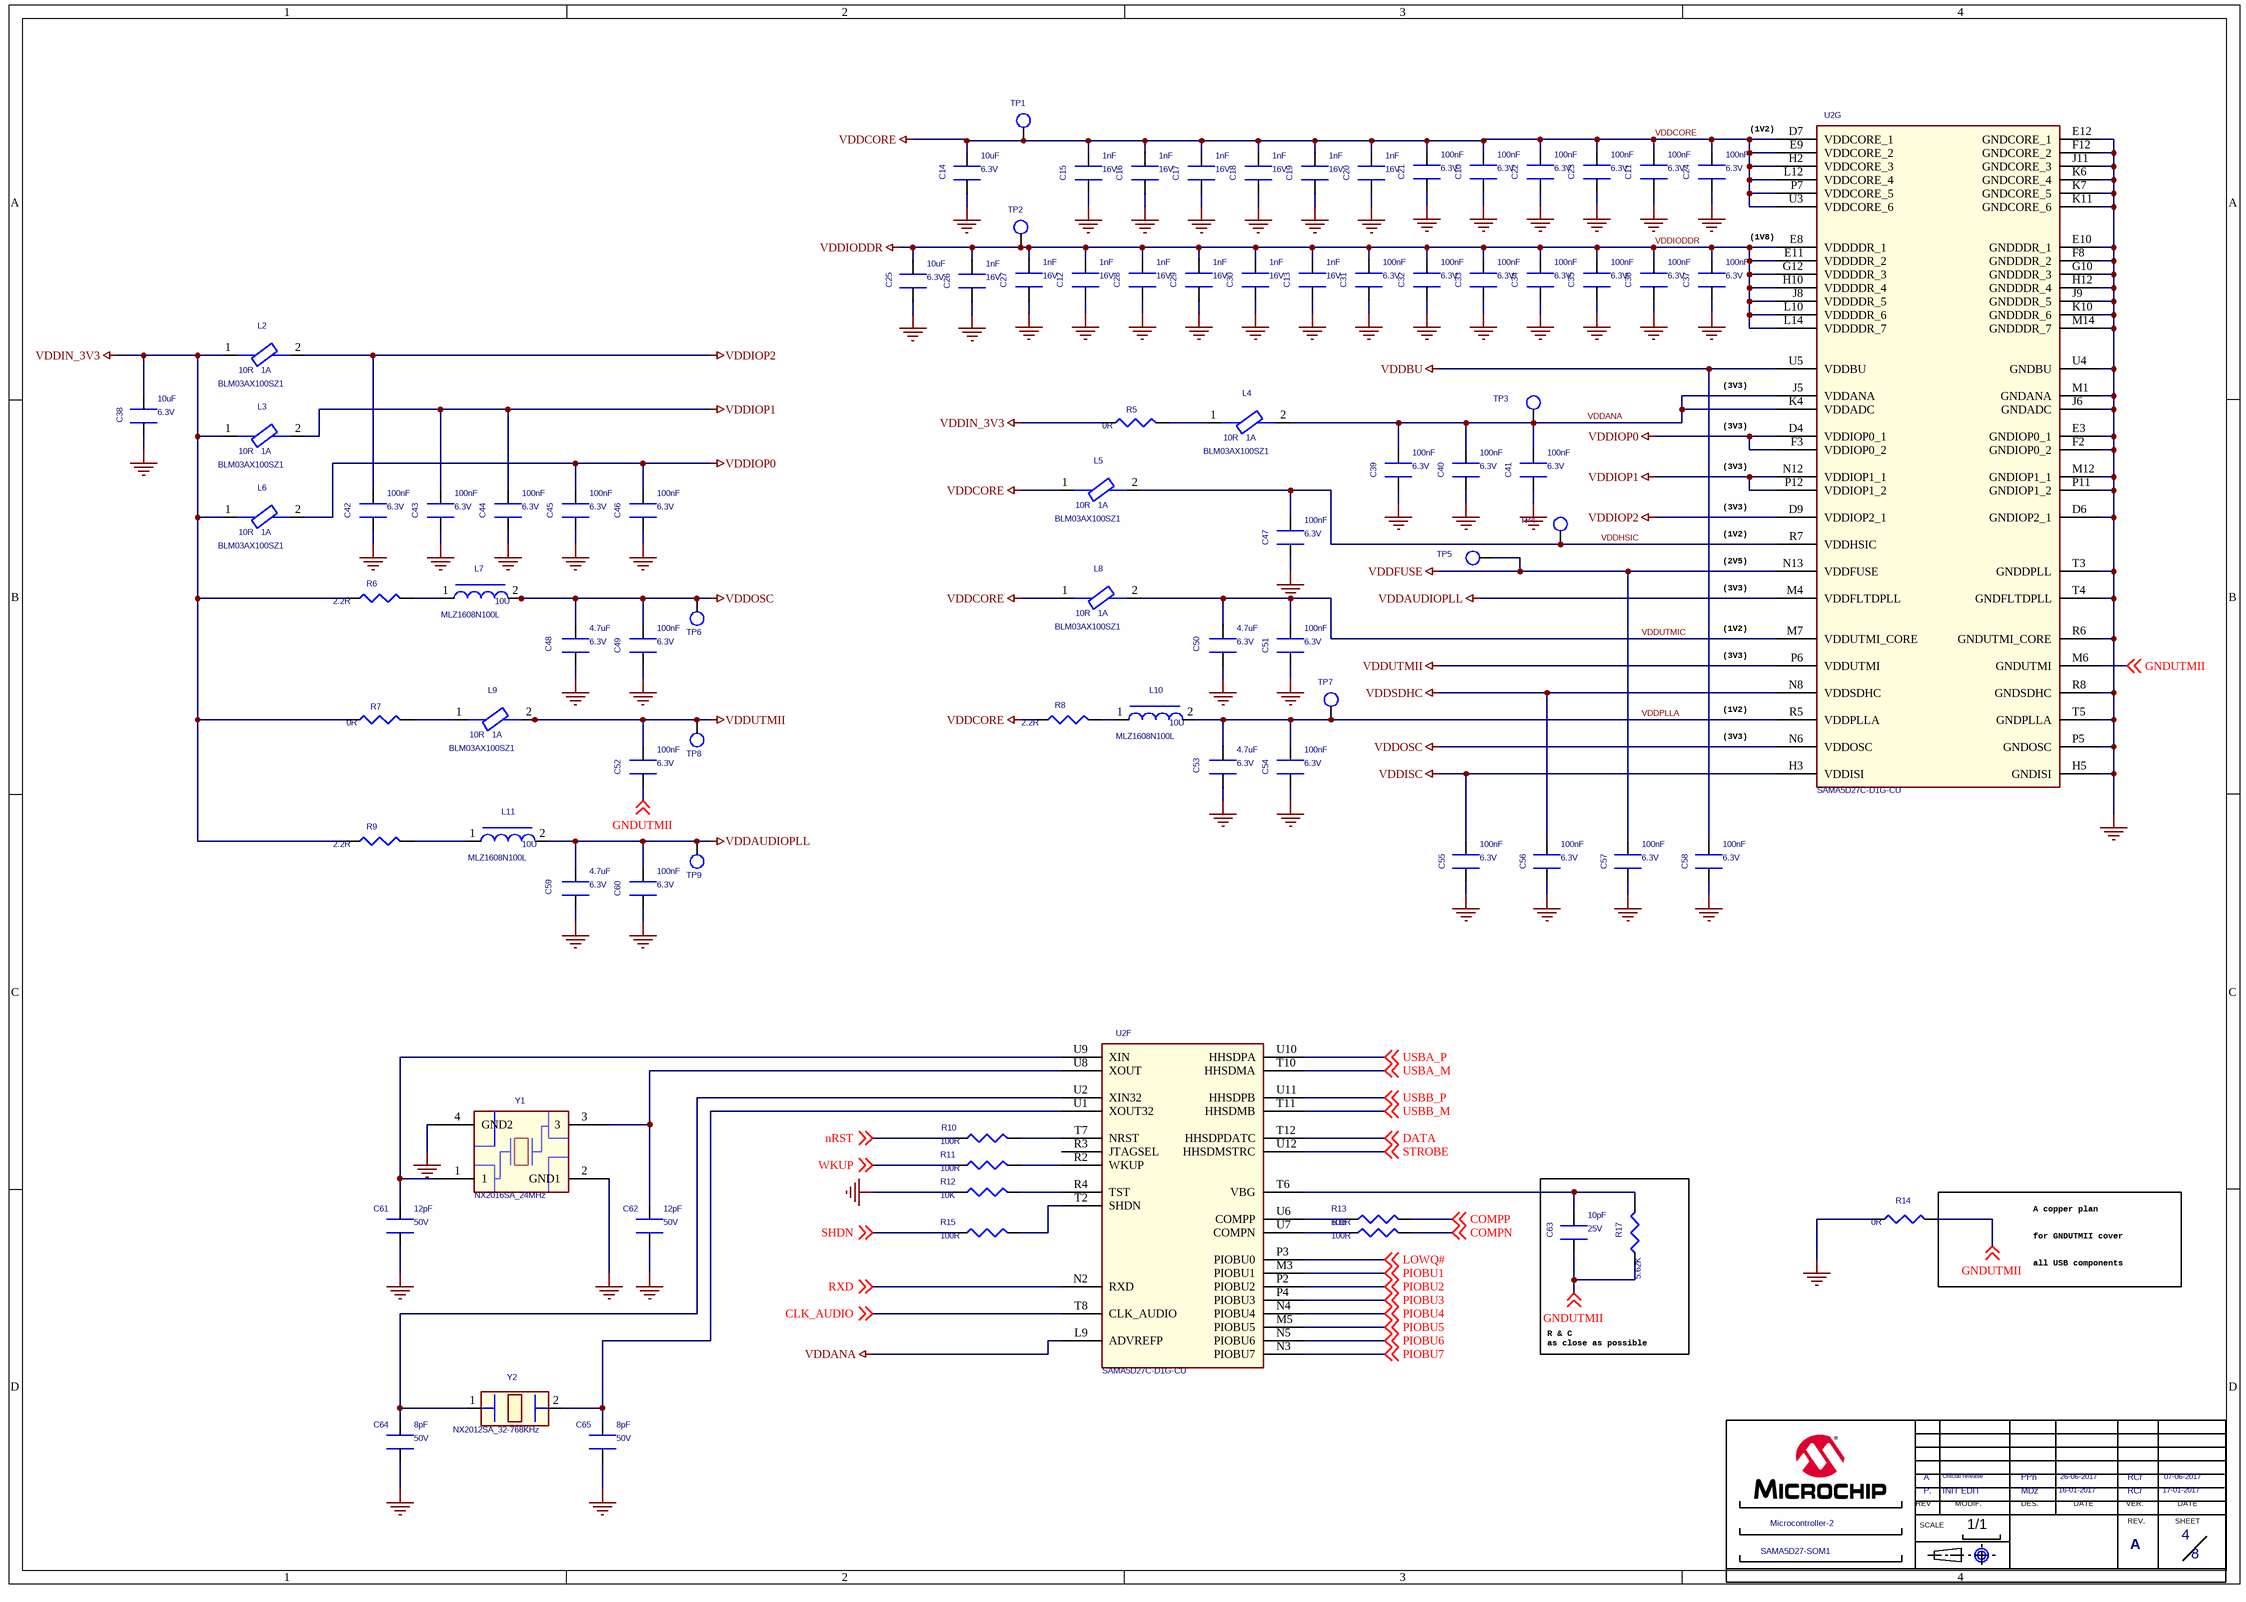
[diagram p3: 4-Microcontroller.SchDoc]

### Parts
(Parts that share a designator on the sheet are numbered #1, #2 ... from top to bottom, then left to right.)
*#4  MODIF.A: INIT EDIT  SHEET NAME 2: Microcontroller-2  SHEET NAME 1: SAMA5D27-SOM1  REV B: A  VERIF B: RCr  VERIF DATE A: 17-01-2017  VERIF DATE B: 07-06-2017  Page Count: 8  Page Number: 4  DATE A: 16-01-2017  DATE B: 26-06-2017  DES A: MDz  DES B: PPn  MODIF.B: Official release  REV A: P.  (hidden comment: CARTOUCHE MICROCHIP)  (graphical)
?#4  (no value)  (graphical)
C10  VALEUR: 100nF  TENSION: 6.3V  [C0201]  (hidden comment: xpF x% xV)
C11  VALEUR: 100nF  TENSION: 6.3V  [C0201]  (hidden comment: xpF x% xV)
C12  TENSION: 16V  VALEUR: 1nF  [C0201]  (hidden comment: xpF x% xV)
C13  TENSION: 16V  VALEUR: 1nF  [C0201]  (hidden comment: xpF x% xV)
C14  TENSION: 6.3V  VALEUR: 10uF  [C0402]  (hidden comment: xpF x% xV)
C15  TENSION: 16V  VALEUR: 1nF  [C0201]  (hidden comment: xpF x% xV)
C16  TENSION: 16V  VALEUR: 1nF  [C0201]  (hidden comment: xpF x% xV)
C17  TENSION: 16V  VALEUR: 1nF  [C0201]  (hidden comment: xpF x% xV)
C18  TENSION: 16V  VALEUR: 1nF  [C0201]  (hidden comment: xpF x% xV)
C19  TENSION: 16V  VALEUR: 1nF  [C0201]  (hidden comment: xpF x% xV)
C20  TENSION: 16V  VALEUR: 1nF  [C0201]  (hidden comment: xpF x% xV)
C21  VALEUR: 100nF  TENSION: 6.3V  [C0201]  (hidden comment: xpF x% xV)
C22  VALEUR: 100nF  TENSION: 6.3V  [C0201]  (hidden comment: xpF x% xV)
C23  VALEUR: 100nF  TENSION: 6.3V  [C0201]  (hidden comment: xpF x% xV)
C24  VALEUR: 100nF  TENSION: 6.3V  [C0201]  (hidden comment: xpF x% xV)
C25  TENSION: 6.3V  VALEUR: 10uF  [C0402]  (hidden comment: xpF x% xV)
C26  TENSION: 16V  VALEUR: 1nF  [C0201]  (hidden comment: xpF x% xV)
C27  TENSION: 16V  VALEUR: 1nF  [C0201]  (hidden comment: xpF x% xV)
C28  TENSION: 16V  VALEUR: 1nF  [C0201]  (hidden comment: xpF x% xV)
C29  TENSION: 16V  VALEUR: 1nF  [C0201]  (hidden comment: xpF x% xV)
C30  TENSION: 16V  VALEUR: 1nF  [C0201]  (hidden comment: xpF x% xV)
C31  VALEUR: 100nF  TENSION: 6.3V  [C0201]  (hidden comment: xpF x% xV)
C32  VALEUR: 100nF  TENSION: 6.3V  [C0201]  (hidden comment: xpF x% xV)
C33  VALEUR: 100nF  TENSION: 6.3V  [C0201]  (hidden comment: xpF x% xV)
C34  VALEUR: 100nF  TENSION: 6.3V  [C0201]  (hidden comment: xpF x% xV)
C35  VALEUR: 100nF  TENSION: 6.3V  [C0201]  (hidden comment: xpF x% xV)
C36  VALEUR: 100nF  TENSION: 6.3V  [C0201]  (hidden comment: xpF x% xV)
C37  VALEUR: 100nF  TENSION: 6.3V  [C0201]  (hidden comment: xpF x% xV)
C38  TENSION: 6.3V  VALEUR: 10uF  [C0402]  (hidden comment: xpF x% xV)
C39  VALEUR: 100nF  TENSION: 6.3V  [C0201]  (hidden comment: xpF x% xV)
C40  VALEUR: 100nF  TENSION: 6.3V  [C0201]  (hidden comment: xpF x% xV)
C41  VALEUR: 100nF  TENSION: 6.3V  [C0201]  (hidden comment: xpF x% xV)
C42  VALEUR: 100nF  TENSION: 6.3V  [C0201]  (hidden comment: xpF x% xV)
C43  VALEUR: 100nF  TENSION: 6.3V  [C0201]  (hidden comment: xpF x% xV)
C44  VALEUR: 100nF  TENSION: 6.3V  [C0201]  (hidden comment: xpF x% xV)
C45  VALEUR: 100nF  TENSION: 6.3V  [C0201]  (hidden comment: xpF x% xV)
C46  VALEUR: 100nF  TENSION: 6.3V  [C0201]  (hidden comment: xpF x% xV)
C47  VALEUR: 100nF  TENSION: 6.3V  [C0201]  (hidden comment: xpF x% xV)
C48  TENSION: 6.3V  VALEUR: 4.7uF  [C0402]  (hidden comment: xpF x% xV)
C49  VALEUR: 100nF  TENSION: 6.3V  [C0201]  (hidden comment: xpF x% xV)
C50  TENSION: 6.3V  VALEUR: 4.7uF  [C0402]  (hidden comment: xpF x% xV)
C51  VALEUR: 100nF  TENSION: 6.3V  [C0201]  (hidden comment: xpF x% xV)
C52  VALEUR: 100nF  TENSION: 6.3V  [C0201]  (hidden comment: xpF x% xV)
C53  TENSION: 6.3V  VALEUR: 4.7uF  [C0402]  (hidden comment: xpF x% xV)
C54  VALEUR: 100nF  TENSION: 6.3V  [C0201]  (hidden comment: xpF x% xV)
C55  VALEUR: 100nF  TENSION: 6.3V  [C0201]  (hidden comment: xpF x% xV)
C56  VALEUR: 100nF  TENSION: 6.3V  [C0201]  (hidden comment: xpF x% xV)
C57  VALEUR: 100nF  TENSION: 6.3V  [C0201]  (hidden comment: xpF x% xV)
C58  VALEUR: 100nF  TENSION: 6.3V  [C0201]  (hidden comment: xpF x% xV)
C59  TENSION: 6.3V  VALEUR: 4.7uF  [C0402]  (hidden comment: xpF x% xV)
C60  VALEUR: 100nF  TENSION: 6.3V  [C0201]  (hidden comment: xpF x% xV)
C61  TENSION: 50V  VALEUR: 12pF  [C0201]  (hidden comment: xpF x% xV)
C62  TENSION: 50V  VALEUR: 12pF  [C0201]  (hidden comment: xpF x% xV)
C63  VALEUR: 10pF  TENSION: 25V  [C0201]  (hidden comment: xpF x% xV)
C64  VALEUR: 8pF  TENSION: 50V  [C0201]  (hidden comment: xpF x% xV)
C65  VALEUR: 8pF  TENSION: 50V  [C0201]  (hidden comment: xpF x% xV)
L2  10R   1A  [L0201]
L3  10R   1A  [L0201]
L4  10R   1A  [L0201]
L5  10R   1A  [L0201]
L6  10R   1A  [L0201]
L7  10U  [L0603_02]
L8  10R   1A  [L0201]
L9  10R   1A  [L0201]
L10  10U  [L0603_02]
L11  10U  [L0603_02]
R5  VALEUR: 0R  [R0201]  (hidden comment: xR x% xW)
R6  VALEUR: 2.2R  [R0201]  (hidden comment: xR x% xW)
R7  VALEUR: 0R  [R0201]  (hidden comment: xR x% xW)
R8  VALEUR: 2.2R  [R0201]  (hidden comment: xR x% xW)
R9  VALEUR: 2.2R  [R0201]  (hidden comment: xR x% xW)
R10  VALEUR: 100R  [R0201]  (hidden comment: xR x% xW)
R11  VALEUR: 100R  [R0201]  (hidden comment: xR x% xW)
R12  VALEUR: 10K  [R0201]  (hidden comment: xR x% xW)
R13  VALEUR: 100R  [R0201]  (hidden comment: xR x% xW)
R14  VALEUR: 0R  [R0402]  (hidden comment: xR x% xW)
R15  VALEUR: 100R  [R0201]  (hidden comment: xR x% xW)
R16  VALEUR: 100R  [R0201]  (hidden comment: xR x% xW)
R17  VALEUR: 5.62K  [R0201]  (hidden comment: xR x% xW)
TP1  TP  [tp-cmsrond-1mm_02]  (value not drawn)
TP2  TP  [tp-cmsrond-1mm_02]  (value not drawn)
TP3  TP  [tp-cmsrond-1mm_02]  (value not drawn)
TP4  TP  [tp-cmsrond-1mm_02]  (value not drawn)
TP5  TP  [tp-cmsrond-1mm_02]  (value not drawn)
TP6  TP  [tp-cmsrond-1mm_02]  (value not drawn)
TP7  TP  [tp-cmsrond-1mm_02]  (value not drawn)
TP8  TP  [tp-cmsrond-1mm_02]  (value not drawn)
TP9  TP  [tp-cmsrond-1mm_02]  (value not drawn)
U2  SAMA5D27C-D1G-CU  [BGA289_02]  (parts F,G of 7)
Y1  NX2016SA_24MHz  [QUARTZ-NX2016SA_01]
Y2  NX2012SA_32-768KHz  [QUARTZ-NX2012SA_01]

### Nets
GND: C10.1 C11.1 C12.1 C13.1 C14.1 C15.1 C16.1 C17.1 C18.1 C19.1 C20.1 C21.1 C22.1 C23.1 C24.1 C25.1 C26.1 C27.1 C28.1 C29.1 C30.1 C31.1 C32.1 C33.1 C34.1 C35.1 C36.1 C37.1 C38.1 C39.1 C40.1 C41.1 C42.1 C43.1 C44.1 C45.1 C46.1 C47.1 C48.1 C49.1 C50.1 C51.1 C53.1 C54.1 C55.1 C56.1 C57.1 C58.1 C59.1 C60.1 C61.1 C62.1 C64.1 C65.1 R12.1 R14.1 U2.D6(GNDIOP2_1) U2.E3(GNDIOP0_1) U2.E10(GNDDDR_1) U2.E12(GNDCORE_1) U2.F2(GNDIOP0_2) U2.F8(GNDDDR_2) U2.F12(GNDCORE_2) U2.G10(GNDDDR_3) U2.H5(GNDISI) U2.H12(GNDDDR_4) U2.J6(GNDADC) U2.J9(GNDDDR_5) U2.J11(GNDCORE_3) U2.K6(GNDCORE_4) U2.K7(GNDCORE_5) U2.K10(GNDDDR_6) U2.K11(GNDCORE_6) U2.M1(GNDANA) U2.M12(GNDIOP1_1) U2.M14(GNDDDR_7) U2.P5(GNDOSC) U2.P11(GNDIOP1_2) U2.R6(GNDUTMI_CORE) U2.R8(GNDSDHC) U2.T3(GNDDPLL) U2.T4(GNDFLTDPLL) U2.T5(GNDPLLA) U2.U4(GNDBU) Y1.2(GND1) Y1.4(GND2)
VDDANA: C39.2 C40.2 C41.2 L4.2 TP3.1 U2.J5(VDDANA) U2.K4(VDDADC) U2.L9(ADVREFP)
VDDAUDIOPLL: C59.2 C60.2 L11.2 TP9.1 U2.M4(VDDFLTDPLL)
VDDBU: C58.2 U2.U5(VDDBU)
VDDCORE: C10.2 C11.2 C14.2 C15.2 C16.2 C17.2 C18.2 C19.2 C20.2 C21.2 C22.2 C23.2 C24.2 L5.1 L8.1 R8.1 TP1.1 U2.D7(VDDCORE_1) U2.E9(VDDCORE_2) U2.H2(VDDCORE_3) U2.L12(VDDCORE_4) U2.P7(VDDCORE_5) U2.U3(VDDCORE_6)
VDDFUSE: C57.2 TP5.1 U2.N13(VDDFUSE)
VDDIN_3V3: C38.2 L2.1 L3.1 L6.1 R5.1 R6.1 R7.1 R9.1
VDDIODDR: C12.2 C13.2 C25.2 C26.2 C27.2 C28.2 C29.2 C30.2 C31.2 C32.2 C33.2 C34.2 C35.2 C36.2 C37.2 TP2.1 U2.E8(VDDDDR_1) U2.E11(VDDDDR_2) U2.G12(VDDDDR_3) U2.H10(VDDDDR_4) U2.J8(VDDDDR_5) U2.L10(VDDDDR_6) U2.L14(VDDDDR_7)
VDDIOP0: C45.2 C46.2 L6.2 U2.D4(VDDIOP0_1) U2.F3(VDDIOP0_2)
VDDIOP1: C43.2 C44.2 L3.2 U2.N12(VDDIOP1_1) U2.P12(VDDIOP1_2)
VDDIOP2: C42.2 L2.2 U2.D9(VDDIOP2_1)
VDDISC: C55.2 U2.H3(VDDISI)
VDDOSC: C48.2 C49.2 L7.2 TP6.1 U2.N6(VDDOSC)
VDDSDHC: C56.2 U2.N8(VDDSDHC)
VDDUTMII: C52.2 L9.2 TP8.1 U2.P6(VDDUTMI)
CLK_AUDIO: U2.T8(CLK_AUDIO) ; off-sheet CLK_AUDIO
COMPN: R16.2 ; off-sheet COMPN
COMPP: R13.2 ; off-sheet COMPP
DATA: U2.T12(HHSDPDATC) ; off-sheet DATA
GNDUTMII: C52.1 C63.1 R14.2 R17.1 U2.M6(GNDUTMI) ; off-sheet GNDUTMII
LOWQ#: U2.P3(PIOBU0) ; off-sheet LOWQ#
nRST: R10.1 ; off-sheet nRST
PIOBU1: U2.M3(PIOBU1) ; off-sheet PIOBU1
PIOBU2: U2.P2(PIOBU2) ; off-sheet PIOBU2
PIOBU3: U2.P4(PIOBU3) ; off-sheet PIOBU3
PIOBU4: U2.N4(PIOBU4) ; off-sheet PIOBU4
PIOBU5: U2.M5(PIOBU5) ; off-sheet PIOBU5
PIOBU6: U2.N5(PIOBU6) ; off-sheet PIOBU6
PIOBU7: U2.N3(PIOBU7) ; off-sheet PIOBU7
RXD: U2.N2(RXD) ; off-sheet RXD
SHDN: R15.1 ; off-sheet SHDN
STROBE: U2.U12(HHSDMSTRC) ; off-sheet STROBE
USBA_M: U2.T10(HHSDMA) ; off-sheet USBA_M
USBA_P: U2.U10(HHSDPA) ; off-sheet USBA_P
USBB_M: U2.T11(HHSDMB) ; off-sheet USBB_M
USBB_P: U2.U11(HHSDPB) ; off-sheet USBB_P
VDDHSIC: C47.2 L5.2 TP4.1 U2.R7(VDDHSIC)
VDDPLLA: C53.2 C54.2 L10.2 TP7.1 U2.R5(VDDPLLA)
VDDUTMIC: C50.2 C51.2 L8.2 U2.M7(VDDUTMI_CORE)
WKUP: R11.1 ; off-sheet WKUP
NetC61_2: C61.2 U2.U9(XIN) Y1.1
NetC62_2: C62.2 U2.U8(XOUT) Y1.3
NetC63_2: C63.2 R17.2 U2.T6(VBG)
NetC64_2: C64.2 U2.U2(XIN32) Y2.1
NetC65_2: C65.2 U2.U1(XOUT32) Y2.2
NetL4_1: L4.1 R5.2
NetL7_1: L7.1 R6.2
NetL9_1: L9.1 R7.2
NetL10_1: L10.1 R8.2
NetL11_1: L11.1 R9.2
NetR10_2: R10.2 U2.T7(NRST)
NetR11_2: R11.2 U2.R2(WKUP)
NetR12_2: R12.2 U2.R4(TST)
NetR13_1: R13.1 U2.U6(COMPP)
NetR15_2: R15.2 U2.T2(SHDN)
NetR16_1: R16.1 U2.U7(COMPN)

Not connected (* = marked no-connect by the designer): U2 R3(JTAGSEL)

### Notes on the sheet
- (1V2)
- (1V8)
- (3V3)
- (2V5)
- A copper plan
- for GNDUTMII cover
- all USB components
- R & C
  as close as possible
- Drawn By:
- Engineer:
- PartNumber:
- Project Title
- Sheet Title
- Size
- B
- Revision:
- Sch #:
- Date:
- Sheet
- Designed with
- Altium.com <http://go.altium.com/MicrochipLandingPage_Evaluation.html>
- File:
- (in symbol CARTOUCHE MICROCHIP) REV; MODIF.; DES.; DATE; VER.; SCALE; REV.; SHEET; 1/1

### Library data of the parts
*#4 = CARTOUCHE MICROCHIP: as *#1 on sheet 1-BLOCK DIAGRAM; VERIF E: XXX; VERIF D: XXX; VERIF C: RCr; VERIF A: RCr; VERIF DATE E: XX-XXX-XX; VERIF DATE D: XX-XXX-XX; VERIF DATE C: 07-06-2017; REV: A; FT: ?; Page Size: A; Page Create Date: june 19, 2004; DATE C: 07-06-2017; DATE D: XX-XXX-XX; DATE E: XX-XXX-XX; DATE F: XX-XXX-XX; DES E: XXX; DES F: XXX; DES C: XXX; DES D: XXX
?#4 = Title Block B
C10 C11 C21-C24 C31-C37 C39-C47 C49 C51 C52 C54-C58 C60 = C0201-100nF-X5R-6.3V: as C9 on sheet 2-Supplies; TEMPERATURE: 40°C/+85°C
C12 C13 C15-C20 C26-C30 = C0201-1nF-X7R-16V-10%: COURANT: xA; HAUTEUR: xmm; TOLERENCE: 10%; DESIGNATION: Condensateur CMS céramique; BOITIER: 0201; DIELECTRIQUE: X7R; TEMPERATURE: 40°C/+85°C
C14 C25 C38 = C0402-10uF-X5R-6.3V: COURANT: xA; HAUTEUR: xmm; TOLERENCE: ?%; DESIGNATION: Condensateur CMS céramique; BOITIER: 0402; DIELECTRIQUE: X5R; TEMPERATURE: 40°C/+85°C
C48 C50 C53 C59 = C0402-4.7uF-X5R-6.3V-10%: as C2 on sheet 2-Supplies; TEMPERATURE: 40°C/+85°C
C61 C62 = C0201-12pF-C0G-50V: COURANT: xA; HAUTEUR: xmm; TOLERENCE: ?%; DESIGNATION: Condensateur CMS céramique; BOITIER: 0201; DIELECTRIQUE: C0G; TEMPERATURE: 40°C/+85°C
C63 = C0201-10pF-C0G-25V: DIELECTRIQUE: C0G; BOITIER: 0201; DESIGNATION: Condensateur CMS céramique; TOLERENCE: ?%; HAUTEUR: xmm; COURANT: xA; TEMPERATURE: 40°C/+85°C
C64 C65 = C0201-8pF-C0G-50V: DIELECTRIQUE: C0G; BOITIER: 0201; DESIGNATION: Condensateur CMS céramique; TOLERENCE: ?%; HAUTEUR: xmm; COURANT: xA; TEMPERATURE: 40°C/+85°C
L2-L6 L8 L9 = BLM03AX100SZ1: DESIGNATION: Ferrite CMS; type: ???; FABRICANT: MURATA; TOLERANCE: 20%; TEMPERATURE: -55°C/+125°C; Valeur: BLM03AX100SZ1; partnumber: BLM03AX100SZ1
L7 L10 L11 = MLZ1608N100L: type: ???; FABRICANT: TDK; TOLERANCE: 20%; DESIGNATION: Inductance CMS; Valeur: MLZ1608N100L; partnumber: MLZ1608N100L; TEMPERATURE: -55°C/+125°C
R5 R7 = R0201-0R: TENSION: xV; BOITIER: 0201; COURANT: xA; DESIGNATION: Resistance CMS; PUISSANCE: xW; TEMPERATURE: -40°C/+85°C; TOLERANCE: x%
R6 R8 R9 = R0201-2.2R-5%: TOLERANCE: 5%; DESIGNATION: Resistance CMS; COURANT: xA; BOITIER: 0201; TENSION: xV; TEMPERATURE: -40°C/+85°C; PUISSANCE: xW
R10 R11 R15 = R0201-100R-5%: TENSION: xV; BOITIER: 0201; COURANT: xA; DESIGNATION: Resistance CMS; TOLERANCE: 5%; PUISSANCE: xW; TEMPERATURE: -40°C/+85°C
R12 = R0201-10K-5%: as R2 on sheet 2-Supplies; PUISSANCE: xW; TEMPERATURE: -40°C/+85°C
R13 R16 = R0201-100R-1%: TOLERANCE: 1%; DESIGNATION: Resistance CMS; COURANT: xA; BOITIER: 0201; TENSION: xV; TEMPERATURE: -40°C/+85°C; PUISSANCE: xW
R14 = R0402-0R: TENSION: xV; BOITIER: 0402; COURANT: xA; DESIGNATION: Resistance CMS; PUISSANCE: xW; TEMPERATURE: -40°C/+85°C; TOLERANCE: x%
R17 = R0201-5.62K-1%: TENSION: xV; BOITIER: 0201; COURANT: xA; DESIGNATION: Resistance CMS; TOLERANCE: 1%; PUISSANCE: xW; TEMPERATURE: -40°C/+85°C
TP1-TP9 = TP: DESIGNATION: POINT DE TEST
U2 = SAMA5D27C-D1G-CU: as U2 on sheet 3-Microcontroller; TEMPERATURE: -40°C/+85°C
Y1 = NX2016SA_24MHz: FABRICANT: NDK; FREQUENCE: 24MHz; DESIGNATION: Quartz 24MHz; TEMPERATURE: -40°C/+85°C
Y2 = NX2012SA_32-768KHz: FABRICANT: NDK; FREQUENCE: 32.768KHz; DESIGNATION: Quartz 32.768KHz; TEMPERATURE: -40°C/+85°C

## Sheet 5-Memories.SchDoc
size 420 x 297 mm; CompanyName: Microchip Technology Inc.; Organization: Microchip Technology; Address1: 2355 West Chandler Blvd.; Address2: Chandler, AZ  85224; Address4: USA; SheetTitle: **; Time: Time
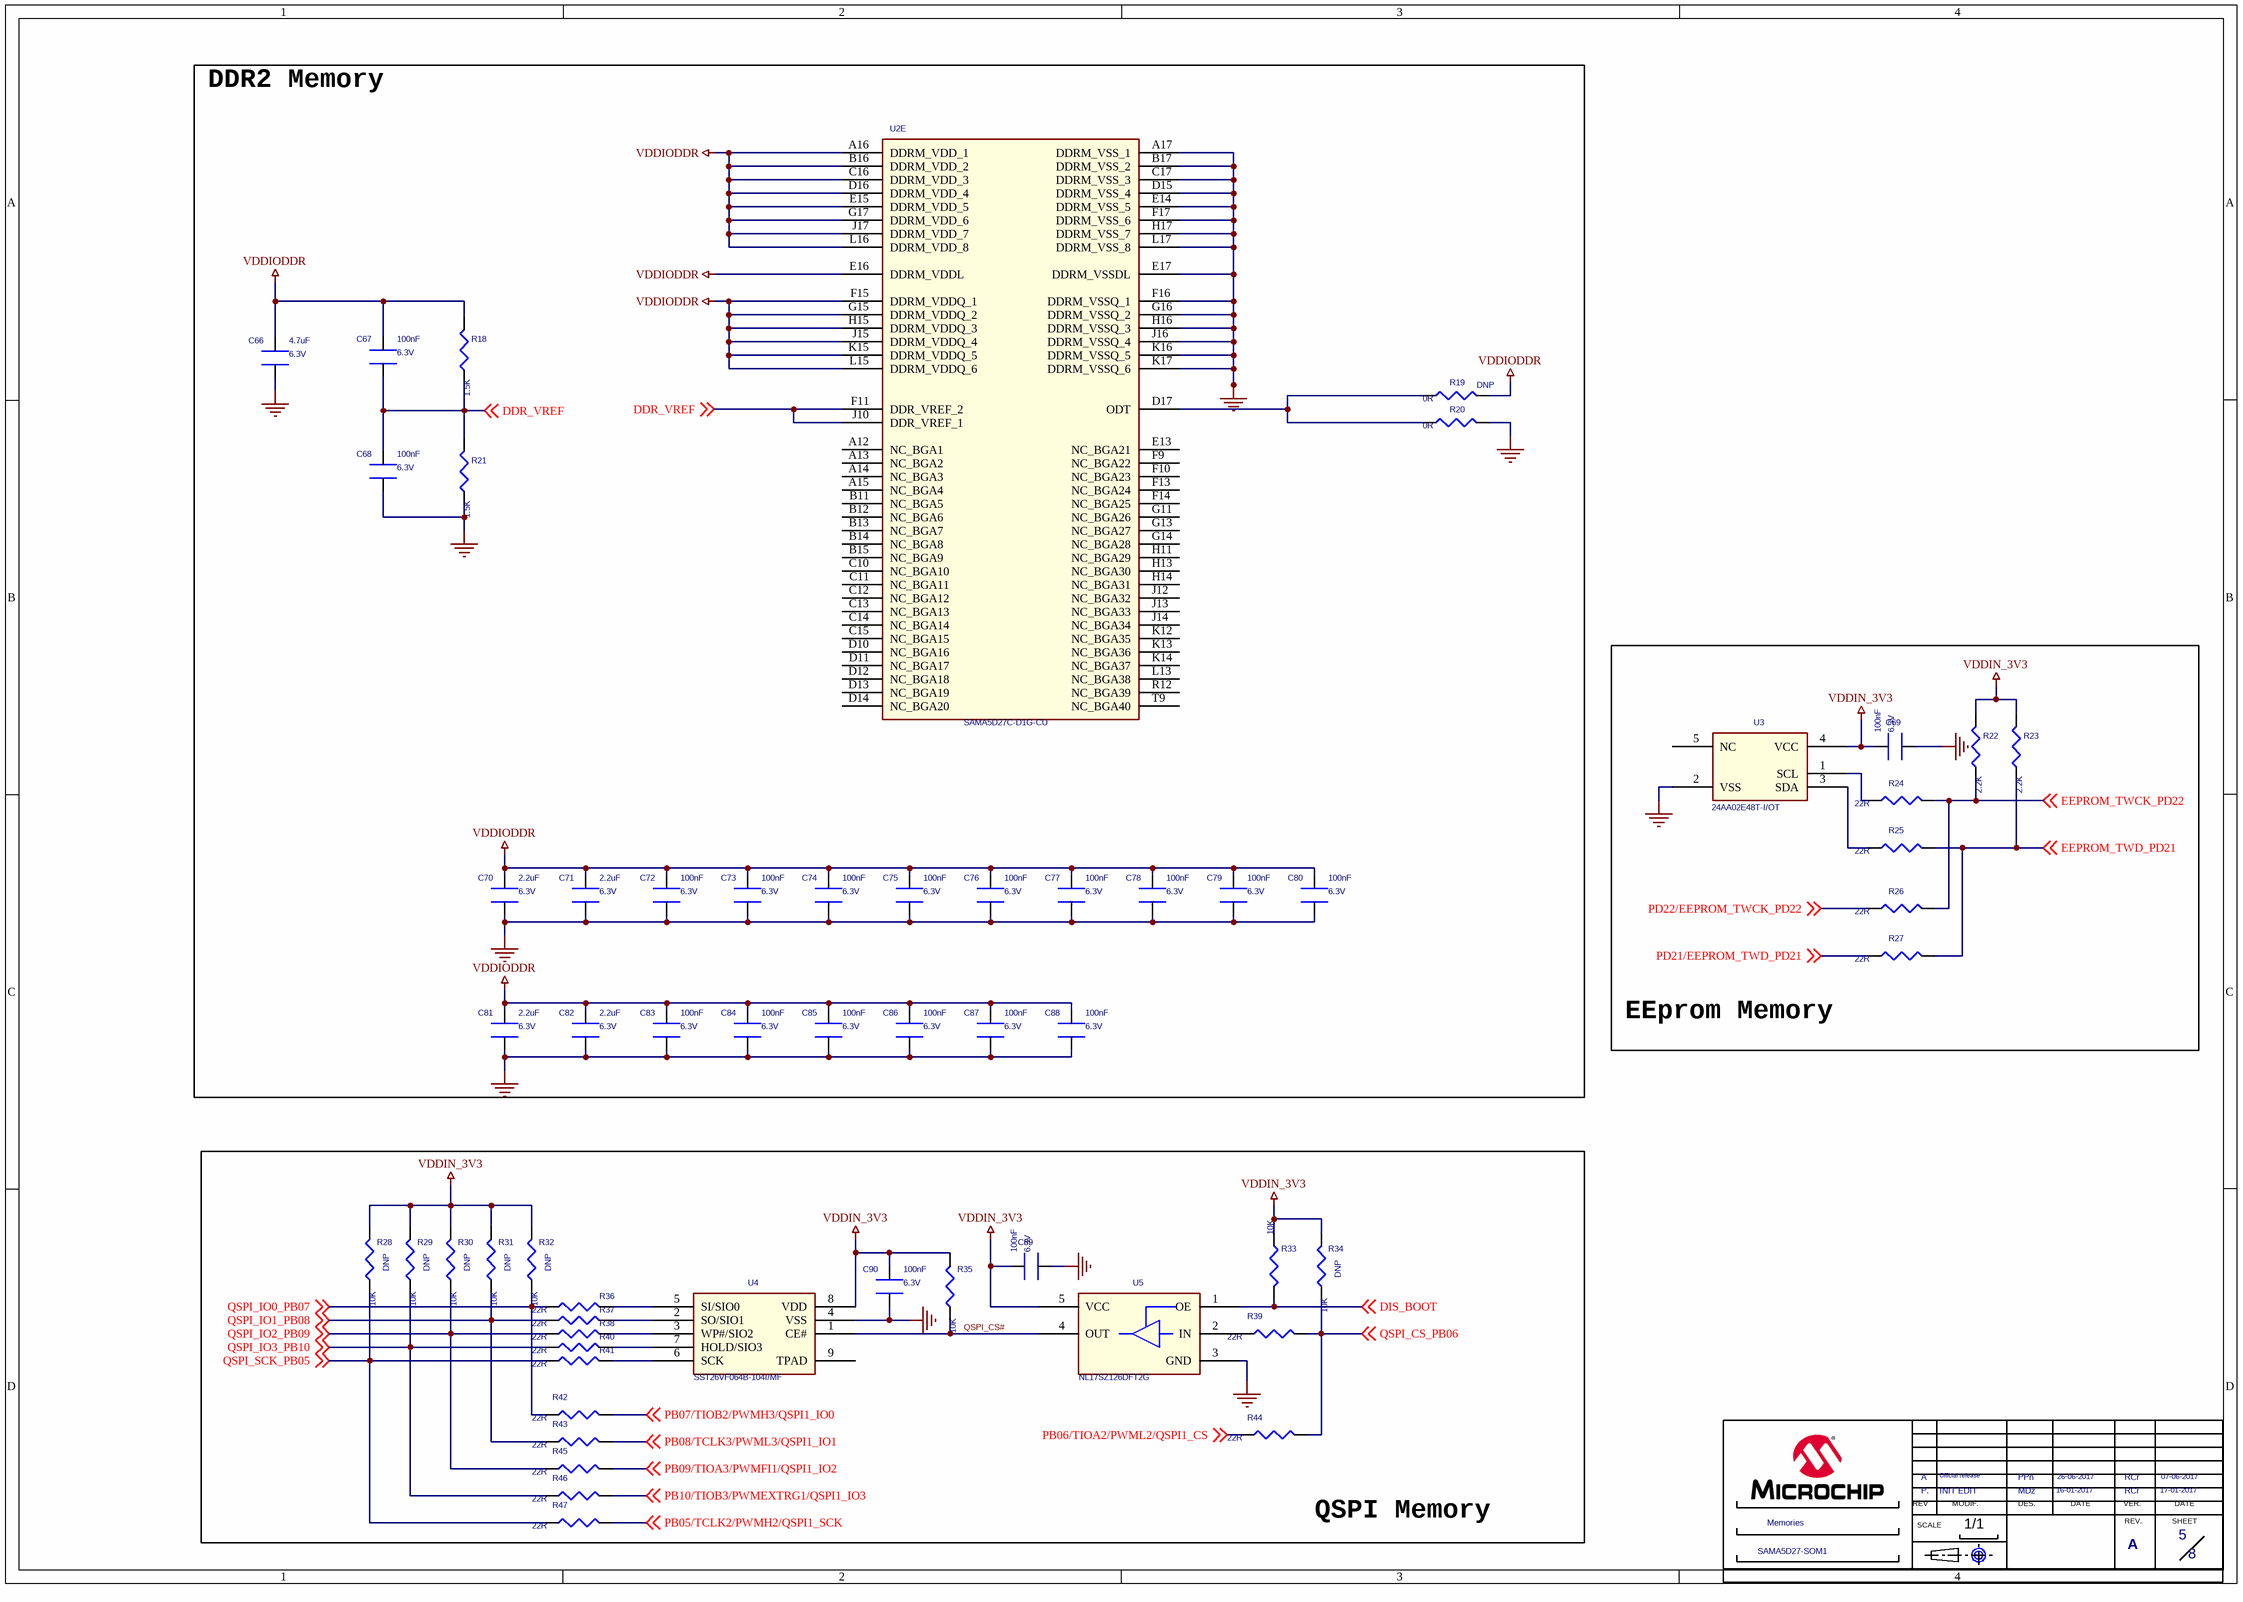
[diagram p4: 5-Memories.SchDoc]

### Parts
(Parts that share a designator on the sheet are numbered #1, #2 ... from top to bottom, then left to right.)
*#5  MODIF.A: INIT EDIT  SHEET NAME 2: Memories  SHEET NAME 1: SAMA5D27-SOM1  REV B: A  VERIF B: RCr  VERIF DATE A: 17-01-2017  VERIF DATE B: 07-06-2017  Page Count: 8  Page Number: 5  DATE A: 16-01-2017  DATE B: 26-06-2017  DES A: MDz  DES B: PPn  MODIF.B: Official release  REV A: P.  (hidden comment: CARTOUCHE MICROCHIP)  (graphical)
?#5  (no value)  (graphical)
C66  TENSION: 6.3V  VALEUR: 4.7uF  [C0402]  (hidden comment: xpF x% xV)
C67  VALEUR: 100nF  TENSION: 6.3V  [C0201]  (hidden comment: xpF x% xV)
C68  VALEUR: 100nF  TENSION: 6.3V  [C0201]  (hidden comment: xpF x% xV)
C69  VALEUR: 100nF  TENSION: 6.3V  [C0201]  (hidden comment: xpF x% xV)
C70  VALEUR: 2.2uF  TENSION: 6.3V  [C0402]  (hidden comment: xpF x% xV)
C71  VALEUR: 2.2uF  TENSION: 6.3V  [C0402]  (hidden comment: xpF x% xV)
C72  VALEUR: 100nF  TENSION: 6.3V  [C0201]  (hidden comment: xpF x% xV)
C73  VALEUR: 100nF  TENSION: 6.3V  [C0201]  (hidden comment: xpF x% xV)
C74  VALEUR: 100nF  TENSION: 6.3V  [C0201]  (hidden comment: xpF x% xV)
C75  VALEUR: 100nF  TENSION: 6.3V  [C0201]  (hidden comment: xpF x% xV)
C76  VALEUR: 100nF  TENSION: 6.3V  [C0201]  (hidden comment: xpF x% xV)
C77  VALEUR: 100nF  TENSION: 6.3V  [C0201]  (hidden comment: xpF x% xV)
C78  VALEUR: 100nF  TENSION: 6.3V  [C0201]  (hidden comment: xpF x% xV)
C79  VALEUR: 100nF  TENSION: 6.3V  [C0201]  (hidden comment: xpF x% xV)
C80  VALEUR: 100nF  TENSION: 6.3V  [C0201]  (hidden comment: xpF x% xV)
C81  VALEUR: 2.2uF  TENSION: 6.3V  [C0402]  (hidden comment: xpF x% xV)
C82  VALEUR: 2.2uF  TENSION: 6.3V  [C0402]  (hidden comment: xpF x% xV)
C83  VALEUR: 100nF  TENSION: 6.3V  [C0201]  (hidden comment: xpF x% xV)
C84  VALEUR: 100nF  TENSION: 6.3V  [C0201]  (hidden comment: xpF x% xV)
C85  VALEUR: 100nF  TENSION: 6.3V  [C0201]  (hidden comment: xpF x% xV)
C86  VALEUR: 100nF  TENSION: 6.3V  [C0201]  (hidden comment: xpF x% xV)
C87  VALEUR: 100nF  TENSION: 6.3V  [C0201]  (hidden comment: xpF x% xV)
C88  VALEUR: 100nF  TENSION: 6.3V  [C0201]  (hidden comment: xpF x% xV)
C89  VALEUR: 100nF  TENSION: 6.3V  [C0201]  (hidden comment: xpF x% xV)
C90  VALEUR: 100nF  TENSION: 6.3V  [C0201]  (hidden comment: xpF x% xV)
R18  VALEUR: 1.5K  [R0201]  (hidden comment: xR x% xW)
R19  VALEUR: 0R  [R0201]  (hidden comment: xR x% xW)
R20  VALEUR: 0R  [R0201]  (hidden comment: xR x% xW)
R21  VALEUR: 1.5K  [R0201]  (hidden comment: xR x% xW)
R22  VALEUR: 2.2K  [R0201]  (hidden comment: xR x% xW)
R23  VALEUR: 2.2K  [R0201]  (hidden comment: xR x% xW)
R24  VALEUR: 22R  [R0201]  (hidden comment: xR x% xW)
R25  VALEUR: 22R  [R0201]  (hidden comment: xR x% xW)
R26  VALEUR: 22R  [R0201]  (hidden comment: xR x% xW)
R27  VALEUR: 22R  [R0201]  (hidden comment: xR x% xW)
R28  VALEUR: 10K  [R0201]  (hidden comment: xR x% xW)
R29  VALEUR: 10K  [R0201]  (hidden comment: xR x% xW)
R30  VALEUR: 10K  [R0201]  (hidden comment: xR x% xW)
R31  VALEUR: 10K  [R0201]  (hidden comment: xR x% xW)
R32  VALEUR: 10K  [R0201]  (hidden comment: xR x% xW)
R33  VALEUR: 10K  [R0201]  (hidden comment: xR x% xW)
R34  VALEUR: 10K  [R0201]  (hidden comment: xR x% xW)
R35  VALEUR: 10K  [R0201]  (hidden comment: xR x% xW)
R36  VALEUR: 22R  [R0201]  (hidden comment: xR x% xW)
R37  VALEUR: 22R  [R0201]  (hidden comment: xR x% xW)
R38  VALEUR: 22R  [R0201]  (hidden comment: xR x% xW)
R39  VALEUR: 22R  [R0201]  (hidden comment: xR x% xW)
R40  VALEUR: 22R  [R0201]  (hidden comment: xR x% xW)
R41  VALEUR: 22R  [R0201]  (hidden comment: xR x% xW)
R42  VALEUR: 22R  [R0201]  (hidden comment: xR x% xW)
R43  VALEUR: 22R  [R0201]  (hidden comment: xR x% xW)
R44  VALEUR: 22R  [R0201]  (hidden comment: xR x% xW)
R45  VALEUR: 22R  [R0201]  (hidden comment: xR x% xW)
R46  VALEUR: 22R  [R0201]  (hidden comment: xR x% xW)
R47  VALEUR: 22R  [R0201]  (hidden comment: xR x% xW)
U2  SAMA5D27C-D1G-CU  [BGA289_02]  (part E of 7)
U3  24AA02E48T-I/OT  [SOT23-5_02]
U4  SST26VF064B-104I/MF  [WDFN08_01]
U5  NL17SZ126DFT2G  [SOT353_01]

### Blocks framed on the sheet
DDR2 Memory: C66-C68 C70-C88 R18-R21 U2
EEprom Memory: C69 R22-R27 U3
QSPI Memory: ?#5 C89 C90 R28-R47 U4 U5

### Nets
GND: C66.1 C68.1 C69.1 C70.1 C71.1 C72.1 C73.1 C74.1 C75.1 C76.1 C77.1 C78.1 C79.1 C80.1 C81.1 C82.1 C83.1 C84.1 C85.1 C86.1 C87.1 C88.1 C89.1 C90.1 R20.2 R21.1 U2.A17(DDRM_VSS_1) U2.B17(DDRM_VSS_2) U2.C17(DDRM_VSS_3) U2.D15(DDRM_VSS_4) U2.E14(DDRM_VSS_5) U2.E17(DDRM_VSSDL) U2.F16(DDRM_VSSQ_1) U2.F17(DDRM_VSS_6) U2.G16(DDRM_VSSQ_2) U2.H16(DDRM_VSSQ_3) U2.H17(DDRM_VSS_7) U2.J16(DDRM_VSSQ_4) U2.K16(DDRM_VSSQ_5) U2.K17(DDRM_VSSQ_6) U2.L17(DDRM_VSS_8) U3.2(VSS) U4.4(VSS) U5.3(GND)
VDDIN_3V3: C69.2 C89.2 C90.2 R22.2 R23.2 R28.2 R29.2 R30.2 R31.2 R32.2 R33.1 R34.2 R35.2 U3.4(VCC) U4.8(VDD) U5.5(VCC)
VDDIODDR: C66.2 C67.2 C70.2 C71.2 C72.2 C73.2 C74.2 C75.2 C76.2 C77.2 C78.2 C79.2 C80.2 C81.2 C82.2 C83.2 C84.2 C85.2 C86.2 C87.2 C88.2 R18.2 R19.2 U2.A16(DDRM_VDD_1) U2.B16(DDRM_VDD_2) U2.C16(DDRM_VDD_3) U2.D16(DDRM_VDD_4) U2.E15(DDRM_VDD_5) U2.E16(DDRM_VDDL) U2.F15(DDRM_VDDQ_1) U2.G15(DDRM_VDDQ_2) U2.G17(DDRM_VDD_6) U2.H15(DDRM_VDDQ_3) U2.J15(DDRM_VDDQ_4) U2.J17(DDRM_VDD_7) U2.K15(DDRM_VDDQ_5) U2.L15(DDRM_VDDQ_6) U2.L16(DDRM_VDD_8)
DDR_VREF: C67.1 C68.2 R18.1 R21.2 U2.F11(DDR_VREF_2) U2.J10(DDR_VREF_1) ; off-sheet DDR_VREF
DIS_BOOT: R33.2 U5.1(OE) ; off-sheet DIS_BOOT
EEPROM_TWCK_PD22: R22.1 R24.2 R26.2 ; off-sheet EEPROM_TWCK_PD22
EEPROM_TWD_PD21: R23.1 R25.2 R27.2 ; off-sheet EEPROM_TWD_PD21
PB05/TCLK2/PWMH2/QSPI1_SCK: R47.2 ; off-sheet PB05/TCLK2/PWMH2/QSPI1_SCK
PB06/TIOA2/PWML2/QSPI1_CS: R44.1 ; off-sheet PB06/TIOA2/PWML2/QSPI1_CS
PB07/TIOB2/PWMH3/QSPI1_IO0: R42.2 ; off-sheet PB07/TIOB2/PWMH3/QSPI1_IO0
PB08/TCLK3/PWML3/QSPI1_IO1: R43.2 ; off-sheet PB08/TCLK3/PWML3/QSPI1_IO1
PB09/TIOA3/PWMFI1/QSPI1_IO2: R45.2 ; off-sheet PB09/TIOA3/PWMFI1/QSPI1_IO2
PB10/TIOB3/PWMEXTRG1/QSPI1_IO3: R46.2 ; off-sheet PB10/TIOB3/PWMEXTRG1/QSPI1_IO3
PD21/EEPROM_TWD_PD21: R27.1 ; off-sheet PD21/EEPROM_TWD_PD21
PD22/EEPROM_TWCK_PD22: R26.1 ; off-sheet PD22/EEPROM_TWCK_PD22
QSPI_CS#: R35.1 U4.1(CE#) U5.4(OUT)
QSPI_CS_PB06: R34.1 R39.2 R44.2 ; off-sheet QSPI_CS_PB06
QSPI_IO0_PB07: R32.1 R36.1 R42.1 ; off-sheet QSPI_IO0_PB07
QSPI_IO1_PB08: R31.1 R37.1 R43.1 ; off-sheet QSPI_IO1_PB08
QSPI_IO2_PB09: R30.1 R38.1 R45.1 ; off-sheet QSPI_IO2_PB09
QSPI_IO3_PB10: R29.1 R40.1 R46.1 ; off-sheet QSPI_IO3_PB10
QSPI_SCK_PB05: R28.1 R41.1 R47.1 ; off-sheet QSPI_SCK_PB05
NetR19_1: R19.1 R20.1 U2.D17(ODT)
NetR24_1: R24.1 U3.1(SCL)
NetR25_1: R25.1 U3.3(SDA)
NetR36_2: R36.2 U4.5(SI/SIO0)
NetR37_2: R37.2 U4.2(SO/SIO1)
NetR38_2: R38.2 U4.3(WP#/SIO2)
NetR39_1: R39.1 U5.2(IN)
NetR40_2: R40.2 U4.7(HOLD/SIO3)
NetR41_2: R41.2 U4.6(SCK)

Not connected (* = marked no-connect by the designer): U2 A12(NC_BGA1) A13(NC_BGA2) A14(NC_BGA3) A15(NC_BGA4) B11(NC_BGA5) B12(NC_BGA6) B13(NC_BGA7) B14(NC_BGA8) B15(NC_BGA9) C10(NC_BGA10) C11(NC_BGA11) C12(NC_BGA12) C13(NC_BGA13) C14(NC_BGA14) C15(NC_BGA15) D10(NC_BGA16) D11(NC_BGA17) D12(NC_BGA18) D13(NC_BGA19) D14(NC_BGA20) E13(NC_BGA21) F9(NC_BGA22) F10(NC_BGA23) F13(NC_BGA24) F14(NC_BGA25) G11(NC_BGA26) G13(NC_BGA27) G14(NC_BGA28) H11(NC_BGA29) H13(NC_BGA30) H14(NC_BGA31) J12(NC_BGA32) J13(NC_BGA33) J14(NC_BGA34) K12(NC_BGA35) K13(NC_BGA36) K14(NC_BGA37) L13(NC_BGA38) R12(NC_BGA39) T9(NC_BGA40); U3 5(NC); U4 9(TPAD)

### Notes on the sheet
- Drawn By:
- Engineer:
- PartNumber:
- Project Title
- Sheet Title
- Size
- B
- Revision:
- Sch #:
- Date:
- Sheet
- Designed with
- Altium.com <http://go.altium.com/MicrochipLandingPage_Evaluation.html>
- File:
- (in symbol CARTOUCHE MICROCHIP) REV; MODIF.; DES.; DATE; VER.; SCALE; REV.; SHEET; 1/1

### Library data of the parts
*#5 = CARTOUCHE MICROCHIP: as *#1 on sheet 1-BLOCK DIAGRAM; VERIF E: XXX; VERIF D: XXX; VERIF C: RCr; VERIF A: RCr; VERIF DATE E: XX-XXX-XX; VERIF DATE D: XX-XXX-XX; VERIF DATE C: 07-06-2017; REV: A; FT: ?; Page Size: A; Page Create Date: june 19, 2004; DATE C: 07-06-2017; DATE D: XX-XXX-XX; DATE E: XX-XXX-XX; DATE F: XX-XXX-XX; DES E: XXX; DES F: XXX; DES C: XXX; DES D: XXX
?#5 = Title Block B
C66 = C0402-4.7uF-X5R-6.3V-10%: as C2 on sheet 2-Supplies; TEMPERATURE: 40°C/+85°C
C67-C69 C72-C80 C83-C90 = C0201-100nF-X5R-6.3V: as C9 on sheet 2-Supplies; TEMPERATURE: 40°C/+85°C
C70 C71 C81 C82 = C0402-2.2uF-X5R-6.3V: DIELECTRIQUE: X5R; BOITIER: 0402; DESIGNATION: Condensateur CMS céramique; TOLERENCE: ?%; HAUTEUR: xmm; COURANT: xA; TEMPERATURE: 40°C/+85°C
R18 R21 = R0201-1.5K-1%: TENSION: xV; BOITIER: 0201; COURANT: xA; DESIGNATION: Resistance CMS; TOLERANCE: 1%; PUISSANCE: xW; TEMPERATURE: -40°C/+85°C
R19 R20 = R0201-0R: as R5 on sheet 4-Microcontroller; PUISSANCE: xW; TEMPERATURE: -40°C/+85°C; TOLERANCE: x%
  R19: DNP: DNP
R22 R23 = R0201-2.2K-5%: TOLERANCE: 5%; DESIGNATION: Resistance CMS; COURANT: xA; BOITIER: 0201; TENSION: xV; TEMPERATURE: -40°C/+85°C; PUISSANCE: xW
R24-R27 R36-R47 = R0201-22R-5%: TENSION: xV; BOITIER: 0201; COURANT: xA; DESIGNATION: Resistance CMS; TOLERANCE: 5%; PUISSANCE: xW; TEMPERATURE: -40°C/+85°C
R28-R32 R34 = R0201-10K-5%-DNP: TOLERANCE: 5%; DESIGNATION: Resistance CMS; COURANT: xA; BOITIER: 0201; TENSION: xV; TEMPERATURE: -40°C/+85°C; PUISSANCE: xW; DNP: DNP
R33 R35 = R0201-10K-5%: as R2 on sheet 2-Supplies; PUISSANCE: xW; TEMPERATURE: -40°C/+85°C
U2 = SAMA5D27C-D1G-CU: as U2 on sheet 3-Microcontroller; TEMPERATURE: -40°C/+85°C
U3 = 24AA02E48T-I-OT: FABRICANT: MICROCHIP; DESIGNATION: EEPROM 2K, 256x8 1.8V Serial EE; TEMPERATURE: -40°C/+85°C
U4 = SST26VF064B-104I-MF: FABRICANT: MICROCHIP; DESIGNATION: Flash Memory 64Mb 2.7-3.6V SQI Flash Memory; TEMPERATURE: -40°C/+85°C
U5 = NL17SZ126DFT2G: FABRICANT: ON SEMI; DESIGNATION: Buffers & Line Drivers 1.65-5.5V Single Non-Inverting; TEMPERATURE: -65°C/+150°C

## Sheet 6-Ethernet.SchDoc
size 420 x 297 mm; CompanyName: Microchip Technology Inc.; Organization: Microchip Technology; Address1: 2355 West Chandler Blvd.; Address2: Chandler, AZ  85224; Address4: USA; SheetTitle: **; Time: Time
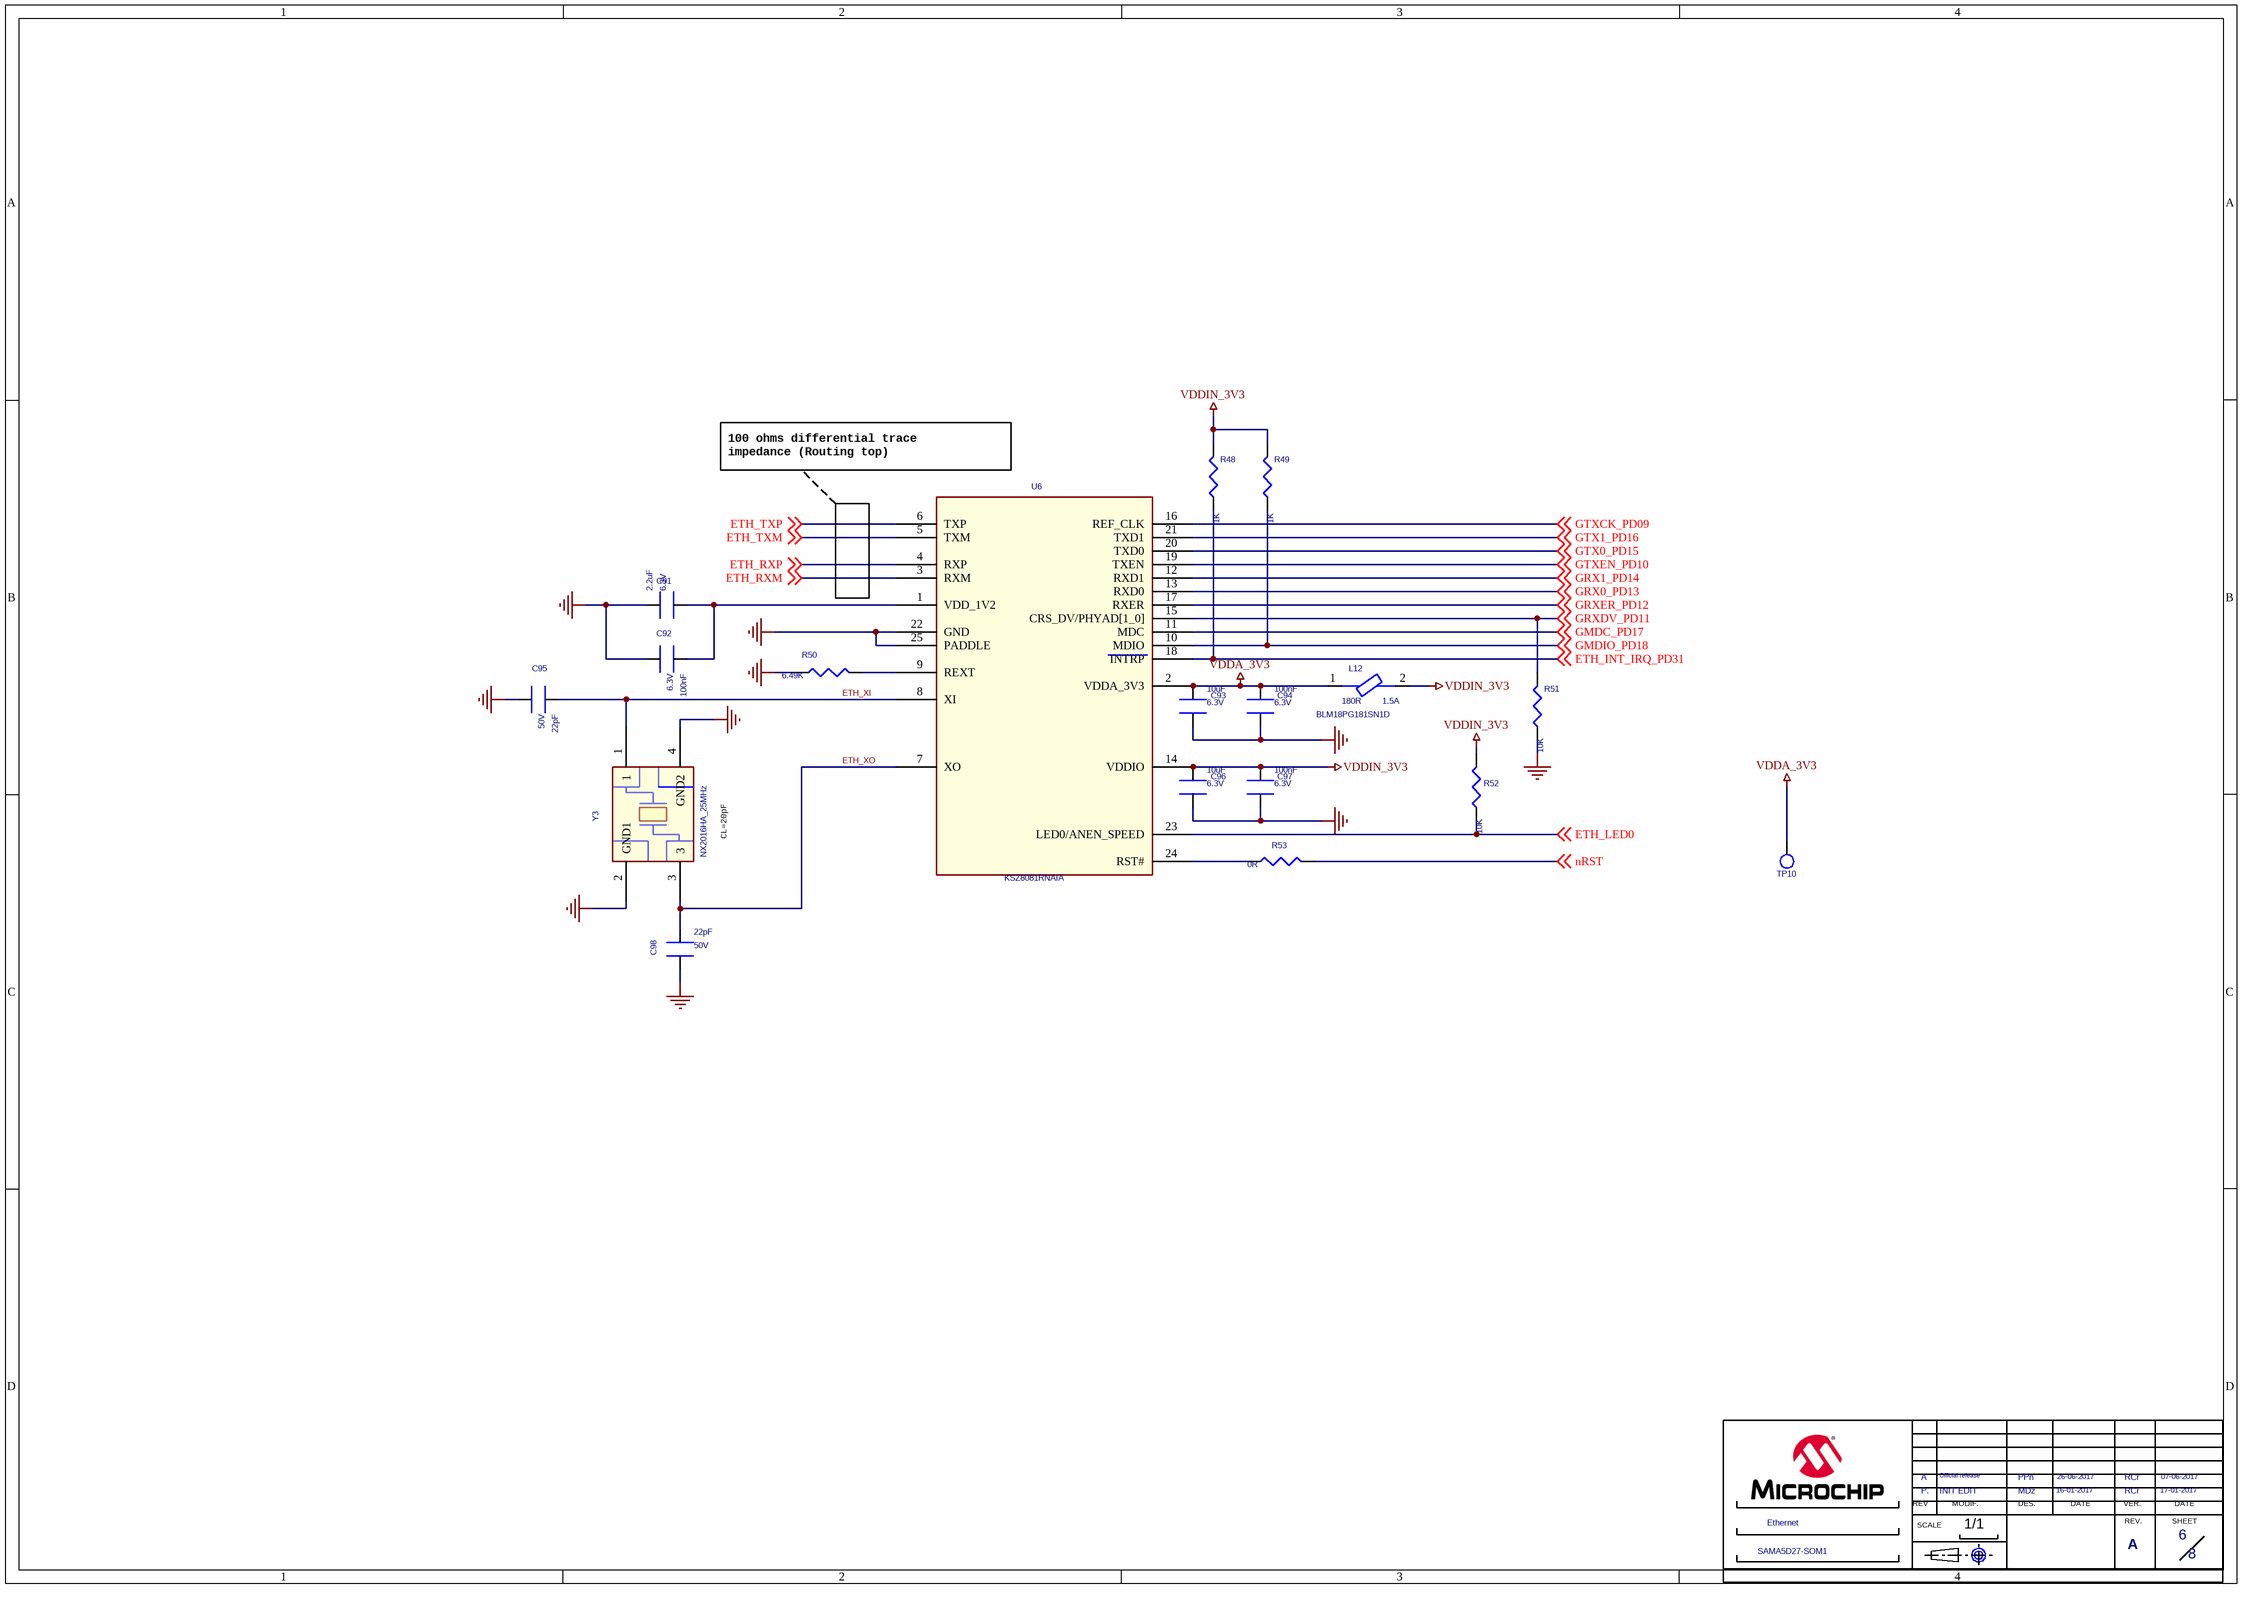
[diagram p5: 6-Ethernet.SchDoc]

### Parts
(Parts that share a designator on the sheet are numbered #1, #2 ... from top to bottom, then left to right.)
*#6  MODIF.A: INIT EDIT  SHEET NAME 2: Ethernet  SHEET NAME 1: SAMA5D27-SOM1  REV B: A  VERIF B: RCr  VERIF DATE A: 17-01-2017  VERIF DATE B: 07-06-2017  Page Count: 8  Page Number: 6  DATE A: 16-01-2017  DATE B: 26-06-2017  DES A: MDz  DES B: PPn  MODIF.B: Official release  REV A: P.  (hidden comment: CARTOUCHE MICROCHIP)  (graphical)
?#6  (no value)  (graphical)
C91  VALEUR: 2.2uF  TENSION: 6.3V  [C0402]  (hidden comment: xpF x% xV)
C92  VALEUR: 100nF  TENSION: 6.3V  [C0201]  (hidden comment: xpF x% xV)
C93  TENSION: 6.3V  VALEUR: 10uF  [C0402]  (hidden comment: xpF x% xV)
C94  VALEUR: 100nF  TENSION: 6.3V  [C0201]  (hidden comment: xpF x% xV)
C95  TENSION: 50V  VALEUR: 22pF  [C0201]  (hidden comment: xpF x% xV)
C96  TENSION: 6.3V  VALEUR: 10uF  [C0402]  (hidden comment: xpF x% xV)
C97  VALEUR: 100nF  TENSION: 6.3V  [C0201]  (hidden comment: xpF x% xV)
C98  TENSION: 50V  VALEUR: 22pF  [C0201]  (hidden comment: xpF x% xV)
L12  180R  COURANT: 1.5A  [L0603_02]
R48  VALEUR: 1K  [R0201]  (hidden comment: xR x% xW)
R49  VALEUR: 1K  [R0201]  (hidden comment: xR x% xW)
R50  VALEUR: 6.49K  [R0402]  (hidden comment: xR x% xW)
R51  VALEUR: 10K  [R0201]  (hidden comment: xR x% xW)
R52  VALEUR: 10K  [R0201]  (hidden comment: xR x% xW)
R53  VALEUR: 0R  [R0201]  (hidden comment: xR x% xW)
TP10  TP  [tp-cmsrond-1mm_02]  (value not drawn)
U6  KSZ8081RNAIA  [QFN24_01]
Y3  NX2016HA_25MHz  [QUARTZ-NX2016HA_01]

### Nets
GND: C91.2 C92.1 C93.1 C94.1 C95.1 C96.1 C97.1 C98.1 R50.1 R51.1 U6.22(GND) U6.25(PADDLE) Y3.2(GND1) Y3.4(GND2)
VDDA_3V3: C93.2 C94.2 L12.1 TP10.1 U6.2(VDDA_3V3)
VDDIN_3V3: C96.2 C97.2 L12.2 R48.2 R49.2 R52.2 U6.14(VDDIO)
ETH_INT_IRQ_PD31: R48.1 U6.18(INTRP) ; off-sheet ETH_INT_IRQ_PD31
ETH_LED0: R52.1 U6.23(LED0/ANEN_SPEED) ; off-sheet ETH_LED0
ETH_RXM: U6.3(RXM) ; off-sheet ETH_RXM
ETH_RXP: U6.4(RXP) ; off-sheet ETH_RXP
ETH_TXM: U6.5(TXM) ; off-sheet ETH_TXM
ETH_TXP: U6.6(TXP) ; off-sheet ETH_TXP
ETH_XI: C95.2 U6.8(XI) Y3.1
ETH_XO: C98.2 U6.7(XO) Y3.3
GMDC_PD17: U6.11(MDC) ; off-sheet GMDC_PD17
GMDIO_PD18: R49.1 U6.10(MDIO) ; off-sheet GMDIO_PD18
GRX0_PD13: U6.13(RXD0) ; off-sheet GRX0_PD13
GRX1_PD14: U6.12(RXD1) ; off-sheet GRX1_PD14
GRXDV_PD11: R51.2 U6.15(CRS_DV/PHYAD[1_0]) ; off-sheet GRXDV_PD11
GRXER_PD12: U6.17(RXER) ; off-sheet GRXER_PD12
GTX0_PD15: U6.20(TXD0) ; off-sheet GTX0_PD15
GTX1_PD16: U6.21(TXD1) ; off-sheet GTX1_PD16
GTXCK_PD09: U6.16(REF_CLK) ; off-sheet GTXCK_PD09
GTXEN_PD10: U6.19(TXEN) ; off-sheet GTXEN_PD10
nRST: R53.2 ; off-sheet nRST
NetC91_1: C91.1 C92.2 U6.1(VDD_1V2)
NetR50_2: R50.2 U6.9(REXT)
NetR53_1: R53.1 U6.24(RST#)

### Notes on the sheet
- 100 ohms differential trace
  impedance (Routing top)
- (near Y3) CL=20pF
- Drawn By:
- Engineer:
- PartNumber:
- Project Title
- Sheet Title
- Size
- B
- Revision:
- Sch #:
- Date:
- Sheet
- Designed with
- Altium.com <http://go.altium.com/MicrochipLandingPage_Evaluation.html>
- File:
- (in symbol CARTOUCHE MICROCHIP) REV; MODIF.; DES.; DATE; VER.; SCALE; REV.; SHEET; 1/1

### Library data of the parts
*#6 = CARTOUCHE MICROCHIP: as *#1 on sheet 1-BLOCK DIAGRAM; VERIF E: XXX; VERIF D: XXX; VERIF C: RCr; VERIF A: RCr; VERIF DATE E: XX-XXX-XX; VERIF DATE D: XX-XXX-XX; VERIF DATE C: 07-06-2017; REV: A; FT: ?; Page Size: A; Page Create Date: june 19, 2004; DATE C: 07-06-2017; DATE D: XX-XXX-XX; DATE E: XX-XXX-XX; DATE F: XX-XXX-XX; DES E: XXX; DES F: XXX; DES C: XXX; DES D: XXX
?#6 = Title Block B
C91 = C0402-2.2uF-X5R-6.3V: as C70 on sheet 5-Memories; TEMPERATURE: 40°C/+85°C
C92 C94 C97 = C0201-100nF-X5R-6.3V: as C9 on sheet 2-Supplies; TEMPERATURE: 40°C/+85°C
C93 C96 = C0402-10uF-X5R-6.3V: as C14 on sheet 4-Microcontroller; TEMPERATURE: 40°C/+85°C
C95 C98 = C0201-22pF-C0G-50V: COURANT: xA; HAUTEUR: xmm; TOLERENCE: ?%; DESIGNATION: Condensateur CMS céramique; BOITIER: 0201; DIELECTRIQUE: C0G; TEMPERATURE: 40°C/+85°C
L12 = BLM18PG181SN1D: partnumber: MLZ1608N100L; TOLERANCE: 25%; FABRICANT: MURATA; type: ???; DESIGNTION: Ferrite CMS; Valeur: BLM18PG181SN1D; TEMPERATURE: -55°C/+125°C
R48 R49 = R0201-1K-5%: TENSION: xV; BOITIER: 0201; COURANT: xA; DESIGNATION: Resistance CMS; TOLERANCE: 5%; PUISSANCE: xW; TEMPERATURE: -40°C/+85°C
R50 = R0402-6.49K-1%: TOLERANCE: 1%; DESIGNATION: Resistance CMS; COURANT: xA; BOITIER: 0402; TENSION: xV; TEMPERATURE: -40°C/+85°C; PUISSANCE: xW
R51 R52 = R0201-10K-5%: as R2 on sheet 2-Supplies; PUISSANCE: xW; TEMPERATURE: -40°C/+85°C
R53 = R0201-0R: as R5 on sheet 4-Microcontroller; PUISSANCE: xW; TEMPERATURE: -40°C/+85°C; TOLERANCE: x%
TP10 = TP: DESIGNATION: POINT DE TEST
U6 = KSZ8081RNAIA: FABRICANT: MICREL; DESIGNATION: Ethernet; TEMPERATURE: -40°C/+85°C
Y3 = NX2016HA_25MHz: FREQUENCE: 25MHz; FABRICANT: NDK; DESIGNATION: Quartz 25MHz; TEMPERATURE: -40°C/+85°C